# EAGLE board jobygnss_v2.1_final (EAGLE 5.11), part 1 of 3
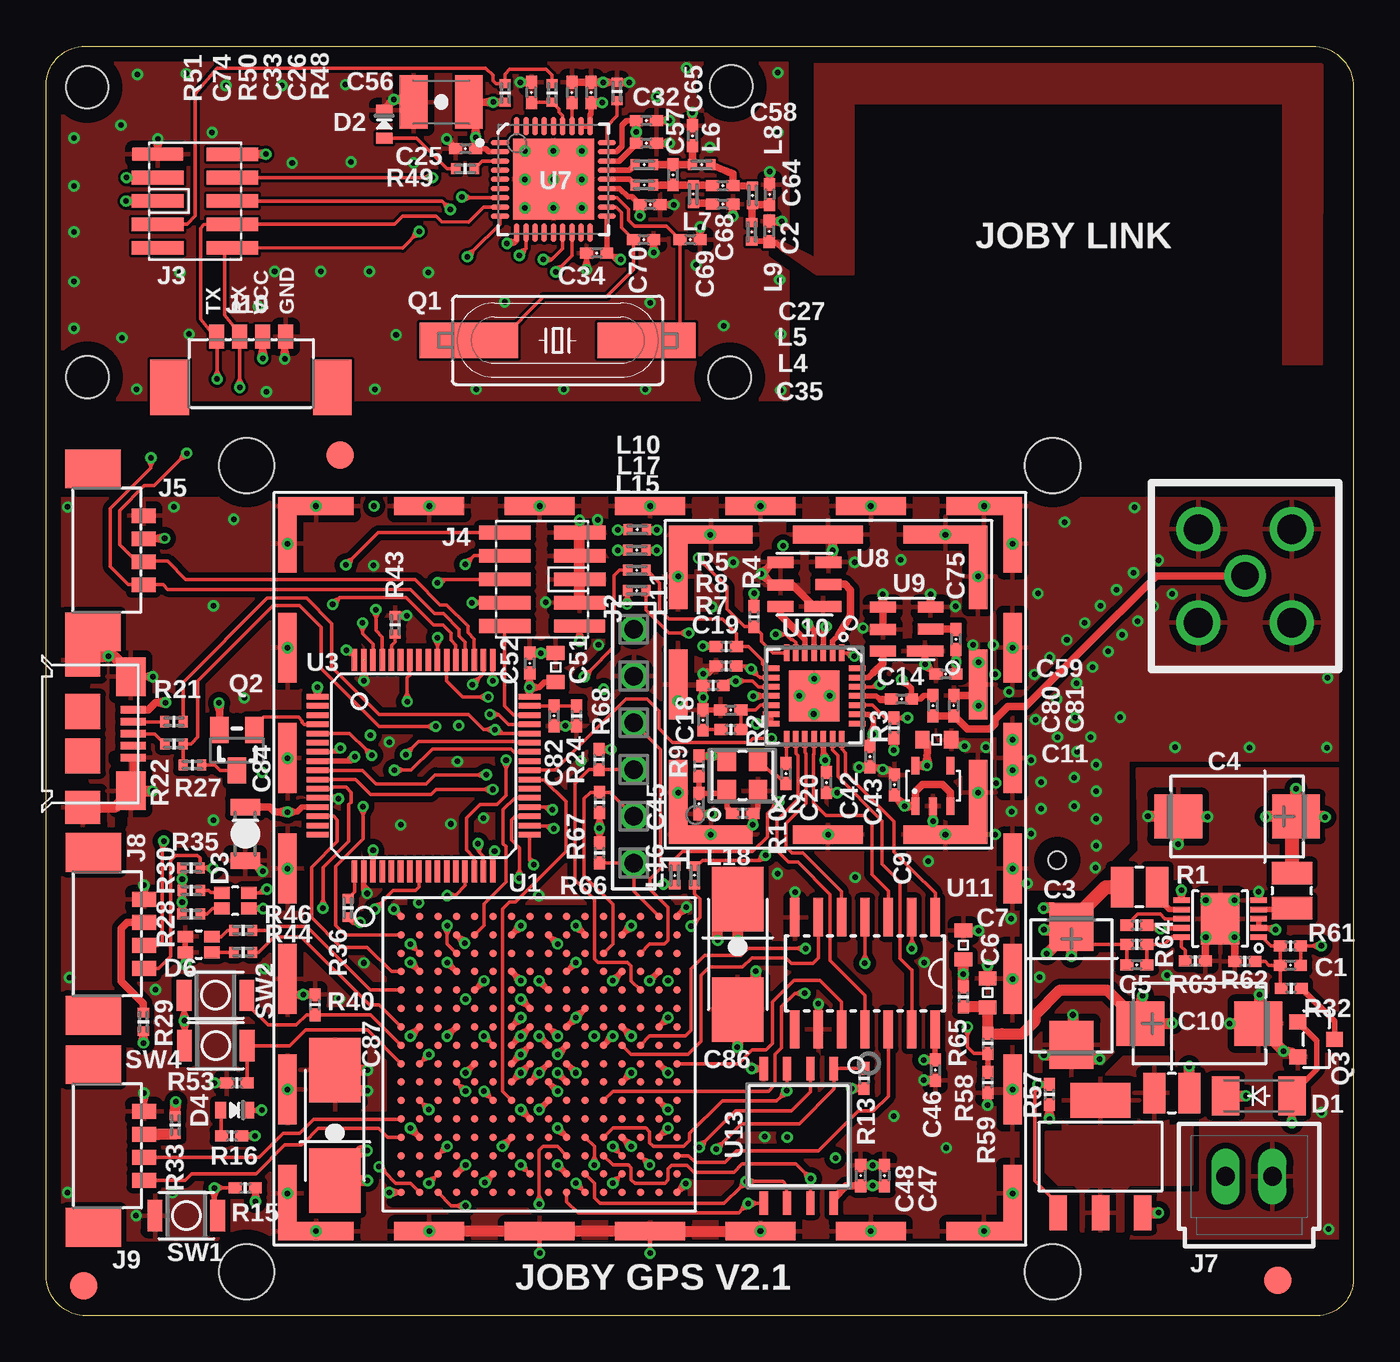
[diagram p5: board, top side]
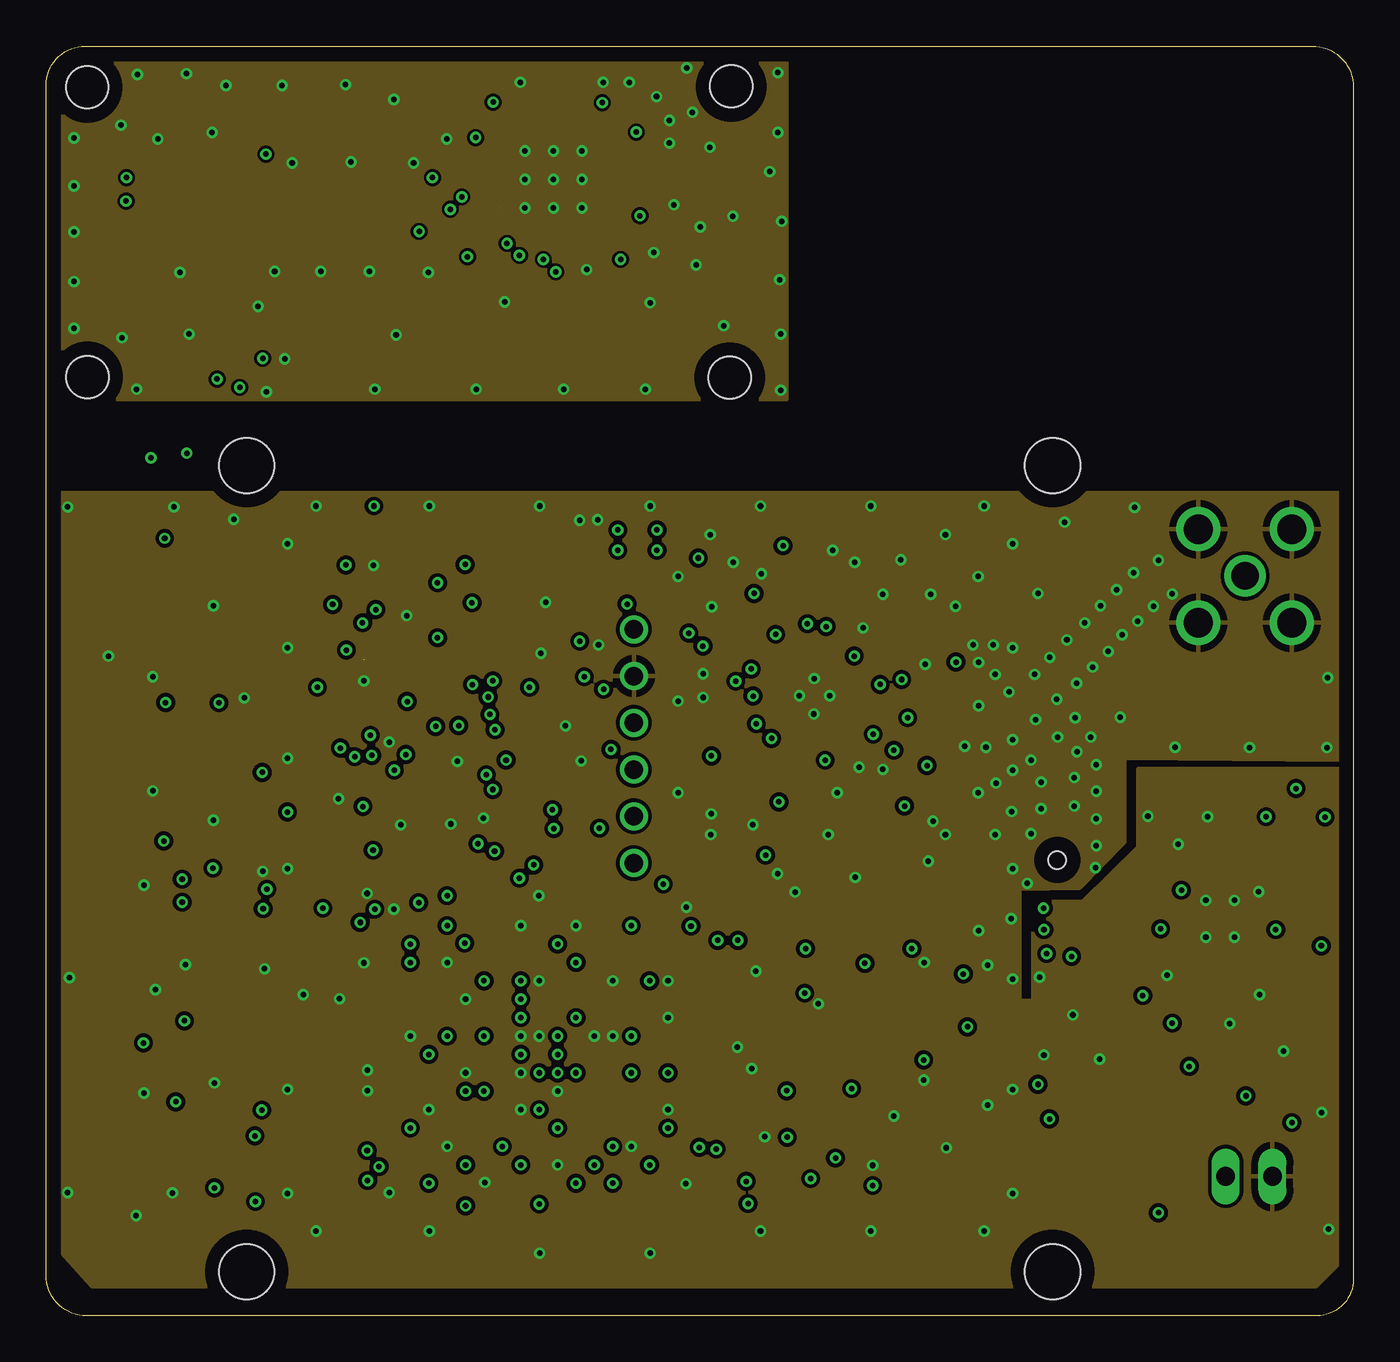
[diagram p6: board, inner layer Route2]
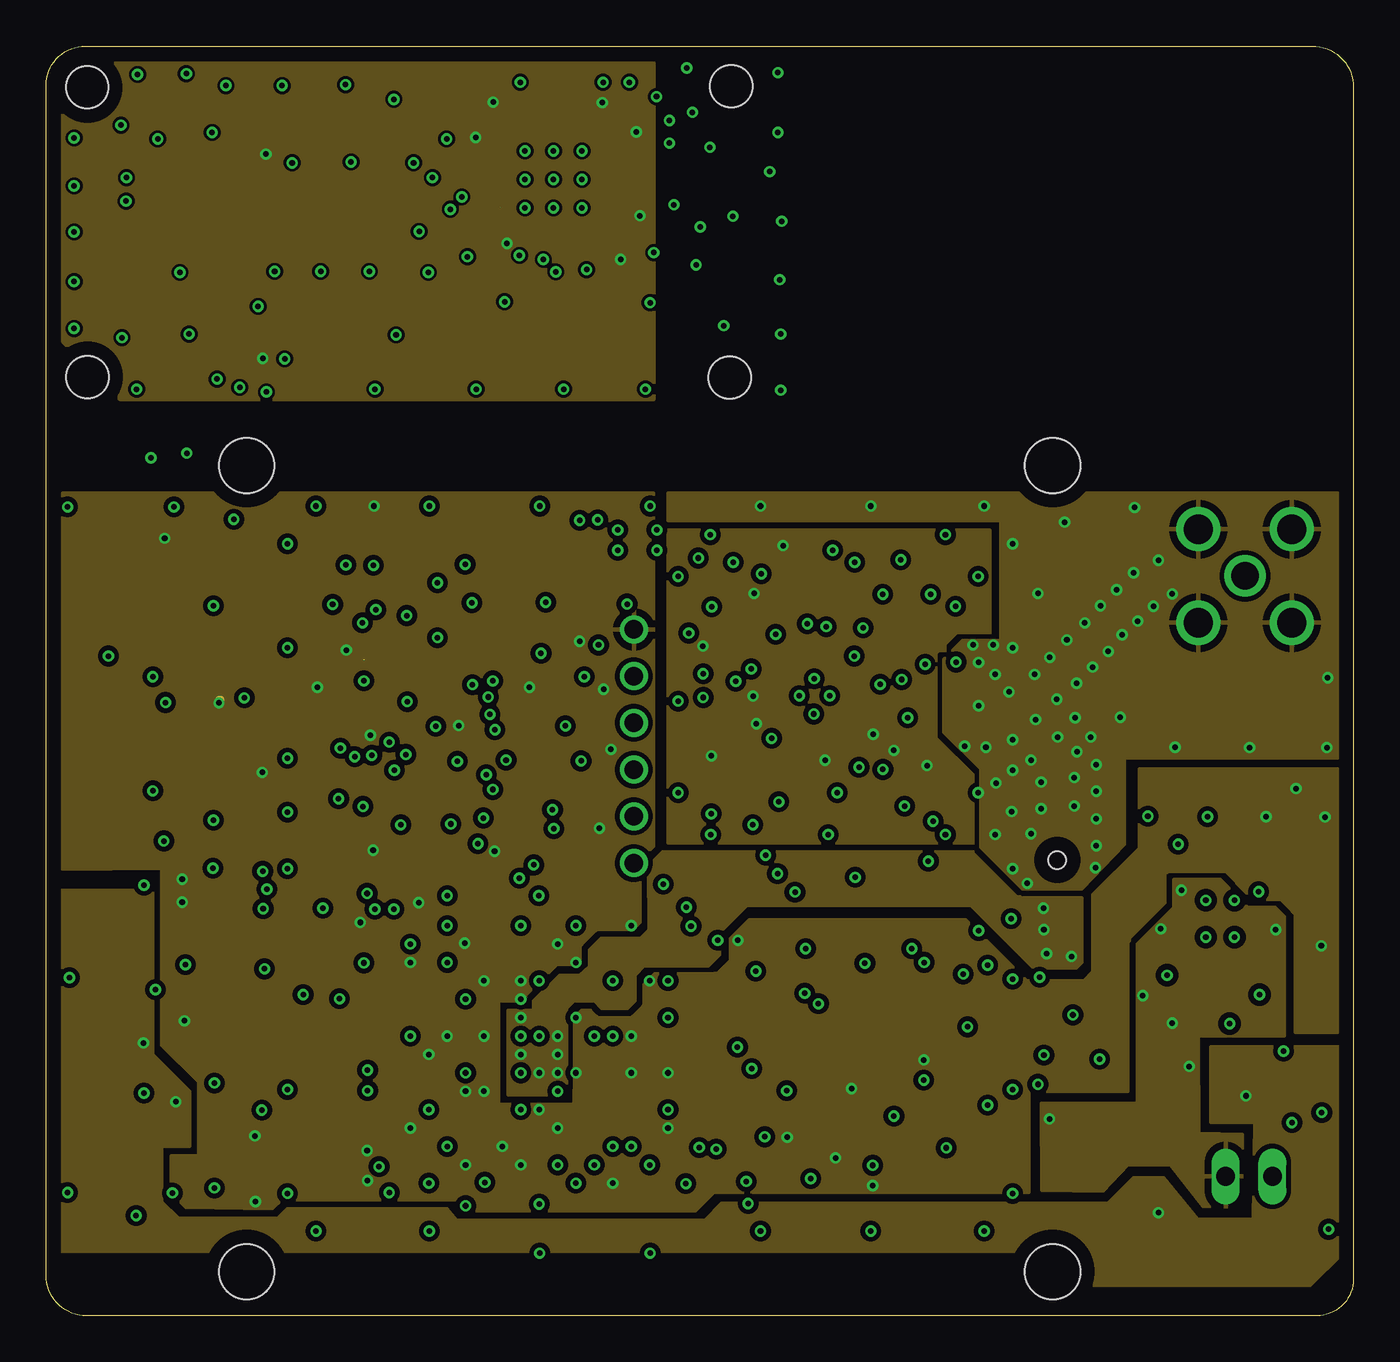
[diagram p7: board, inner layer Route15]
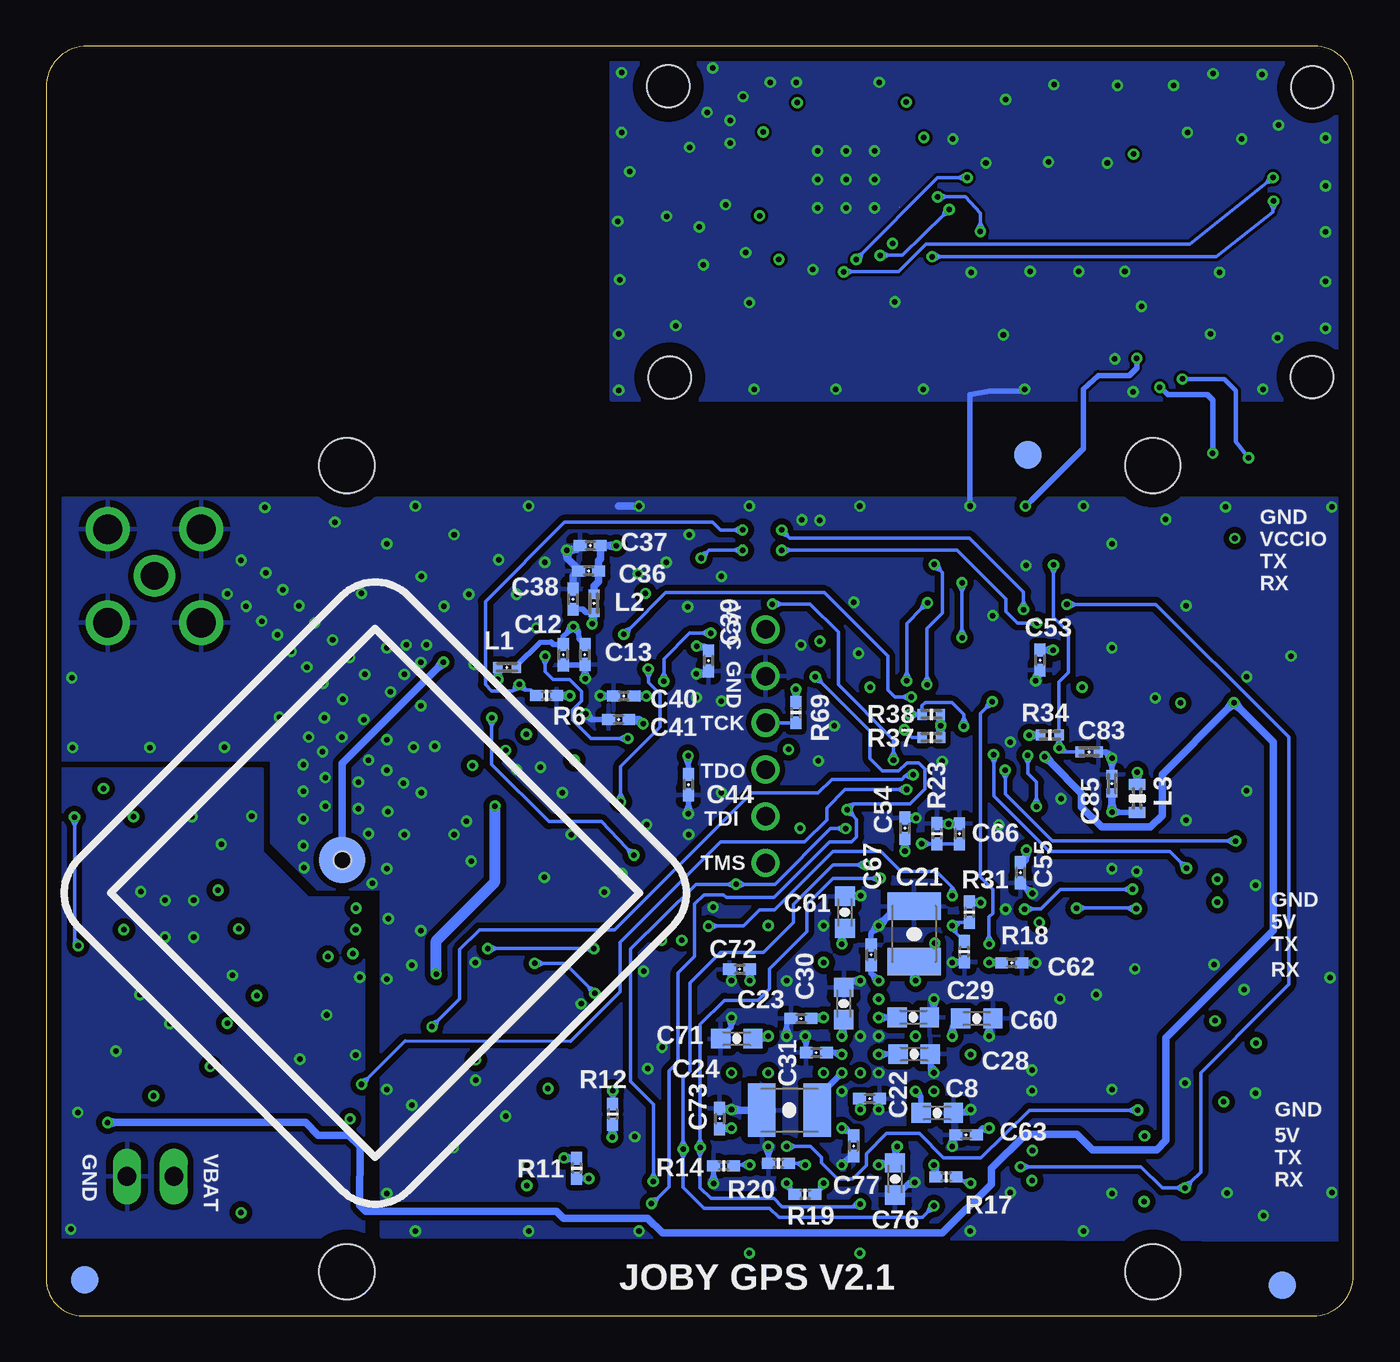
[diagram p8: board, bottom side, seen from below]

Size 71.05 x 69 mm. Coordinates in mm from the lower left corner, seen from the top.
Outline: 0,66.85 arc-90 2.15,69 68.8,69 arc-90 71.05,66.75 71.05,2 arc-90 69.05,0 2.2,0 arc-90 0,2.2 0,66.85
Copper layers (1+2*15+16): Top 0.035mm / dielectric 0.25mm / Route2 0.035mm / dielectric 0.25mm / Route15 0.035mm / dielectric 0.25mm / Bottom 0.035mm
Design rules "default *": minimum track width 6mil, minimum drill 0.3mm, track to track 6mil, track to pad 6mil, pad to pad 6mil, via to via 6mil, smd to smd 6mil, copper to edge 30mil, drill to drill 8mil, minimum pad ring 10mil, minimum via ring 0.145mm, stop-mask expansion 4mil, vias tented up to drill 0.3mm, thermal gap 15mil
Holes 2.3 mm at 2.24,66.76 2.25,51.01 37.15,50.98 37.24,66.81
Holes 3 mm at 10.9,46.2 54.7,46.2 10.9,2.4 54.7,2.4
tRestrict: area 18.8,6.2 to 34.6,22; area 12.9,8.4 to 13.1,8.5; area 10.1,28.4 to 10.3,28.5; area 12.3,30.2 to 12.4,30.4; area 1.9,28.8 to 2.1,28.9; area 3.7,30.2 to 3.8,30.4; area 1.9,34.3 to 2.1,34.4; area 13.8,36.2 to 13.9,36.4; area 27.5,31.3 to 27.7,31.4; area 25.7,35.9 to 25.8,36.1; area 28.4,35.9 to 28.4,36.1; area 44.7,29.2 to 44.9,29.3; area 10.3,32.4 to 10.5,32.5; area 12.4,12.2 to 12.4,12.4; area 4.5,14.9 to 4.6,15.1; area 4.1,26.7 to 4.1,26.9; area 37.1,14.2 to 37.1,14.4; area 37.9,12.9 to 38.1,13; area 39.1,20.4 to 39.2,20.6; area 47.5,34.8 to 47.7,34.9; area 43.9,30.3 to 44.1,30.4; area 43.2,28 to 43.4,28; area 34.2,32.1 to 34.5,32.2; area 41.6,35.2 to 41.9,35.2; area 41.6,32.1 to 41.9,32.2; area 43.2,33.6 to 43.3,33.8; area 40.1,33.6 to 40.2,33.8; area 51.8,41.9 to 51.8,42.1; area 51.3,42.4 to 51.4,42.6; area 67.9,14.8 to 68.1,14.8

## Footprints (pad centres in the part's own frame; a part is rotated, then mirrored left to right if it is on the bottom)
GPS_PATCH_ANTENNA = smd 2.54 x 2.54: P$1 0,-2.54 | hole 0.965: 0,-2.54
C0402 = smd 0.7 x 0.6: 1 -0.55,0; 2 0.55,0
CT7343 = smd 2.6 x 2.4: + -3.2,0; - 3.2,0
0603 = smd 0.762 x 0.965: 1 -0.787,0; 2 0.787,0
C0603K = smd 1.05 x 1.08: 1 -0.875,0; 2 0.875,0
C1210K = smd 1.5 x 2.9: 1 -1.5,0; 2 1.5,0
0402-CAP = smd 0.5 x 0.6: P$1 -0.5,0; P$2 0.5,0
1206-POL-CAP = smd 0.9 x 1.6: + -1.45,0; - 1.45,0
6032/C = smd 3.5 x 2.8: + -3,0; - 3,0
SOD-123_MINI-SMA = smd 1.5 x 2.1: A 1.8,0; C -1.8,0
0603-LED = smd 0.6 x 0.9: A 0.75,0; C -0.75,0
LTST-C195KGJRKT = smd 0.65 x 0.85: GA 0.425,0.725; GC 0.425,-0.725; RA -0.425,0.725; RC -0.425,-0.725
SMA = drill 1.499 round: P$1 0,0 | drill 1.6 round: P$2 2.54,2.54; P$3 2.54,-2.54; P$4 -2.54,-2.54; P$5 -2.54,2.54
SSW-106-02-S-S = drill 1 pad 1.524 round: 1 -6.35,0; 2 -3.81,0; 3 -1.27,0; 4 1.27,0; 5 3.81,0; 6 6.35,0
FTSH-105-DV = smd 0.74 x 2.8: 1 -2.54,-2.03; 2 -2.54,2.03; 3 -1.27,-2.03; 4 -1.27,2.03; 5 0,-2.03; 6 0,2.03; 7 1.27,-2.03; 8 1.27,2.03; 9 2.54,-2.03; 10 2.54,2.03
PB-53398-04 = smd 0.8 x 1.3: 1 -1.875,1.25; 2 -0.625,1.25; 3 0.625,1.25; 4 1.875,1.25 | smd 2.1 x 3: PAD1 -4.425,-1.5; PAD2 4.425,-1.5
ZX62-B-5PA = smd 1.8 x 1.9: GND_LEFT -4,0; GND_RIGHT 4,0 | smd 1.9 x 1.9: GND_MID_LEFT -1.2,0; GND_MID_RIGHT 1.2,0 | smd 2.1 x 1.6: GND_UP_LEFT -3.1,2.6; GND_UP_RIGHT 3.1,2.6 | smd 0.4 x 1.35: PIN_1 -1.3,2.725; PIN_2 -0.65,2.725; PIN_3 0,2.725; PIN_4 0.65,2.725; PIN_5 1.3,2.725
70543-02 = drill 1.016 long: 1 -1.27,0; 2 1.27,0
FIDUCIAL-1.5X3 = smd 1.5 x 1.5: 1 0,0
0402-IND = smd 0.5 x 0.6: P$1 -0.5,0; P$2 0.5,0
0603-IND@1 = smd 0.6 x 0.9: P$1 -0.75,0; P$2 0.75,0
LQM2HPN4R7MG0L = smd 1.2 x 2.2: 1 -0.95,0; 2 0.95,0
HC49UP = smd 5.334 x 1.93: 1 -4.826,0; 2 4.826,0
SOT23 = smd 1 x 1.4: 1 -0.95,-1.1; 2 0.95,-1.1; 3 0,1.1
2N7002 = smd 0.8 x 0.9: D 0,0; G -0.95,-2; S 0.95,-2
FDT458P_SOT223 = smd 0.95 x 1.9: 1 -2.3,-6.1; 2 0,-6.1; 3 2.3,-6.1 | smd 3.25 x 1.9: 4 0,0
R0402 = smd 0.7 x 0.6: 1 -0.55,0; 2 0.55,0
0402-RES = smd 0.5 x 0.6: P$1 -0.5,0; P$2 0.5,0
BMI-S-202 = smd 4.55 x 1: 1 2.275,0.5; 3 15.025,0.5; 7 15.025,16.8; 9 2.275,16.8 | smd 3.8 x 1: 2 8.65,0.5; 8 8.65,16.8 | smd 1 x 3.55: 4 16.8,2.775; 6 16.8,14.525; 10 0.5,14.525; 12 0.5,2.775 | smd 1 x 3.8: 5 16.8,8.65; 11 0.5,8.65
BMI-S-208 = smd 4.1 x 1: 1 2.05,0.5; 3 38.35,0.5; 7 38.35,39.9; 9 2.05,39.9 | smd 3.8 x 1: 2 8.2,0.5; 8 8.2,39.9; 13 14.2,0.5; 14 20.2,0.5; 15 26.2,0.5; 16 32.2,0.5; 25 14.2,39.9; 26 20.2,39.9; 27 26.2,39.9; 28 32.2,39.9 | smd 1 x 3.1: 4 39.9,2.55; 6 39.9,37.85; 10 0.5,37.85; 12 0.5,2.55 | smd 1 x 3.8: 5 39.9,8.2; 11 0.5,8.2; 17 39.9,14.2; 18 39.9,20.2; 19 39.9,32.2; 20 0.5,14.2; 21 39.9,26.2; 22 0.5,20.2; 23 0.5,26.2; 24 0.5,32.2
B3U-1000P = smd 0.8 x 1.7: P$1 -1.7,0; P$2 1.7,0
FT256 = smd 0.4 x 0.4: A1 -7.5,7.5; A2 -6.5,7.5; A3 -5.5,7.5; A4 -4.5,7.5; A5 -3.5,7.5; A6 -2.5,7.5; A7 -1.5,7.5; A8 -0.5,7.5; A9 0.5,7.5; A10 1.5,7.5; A11 2.5,7.5; A12 3.5,7.5; A13 4.5,7.5; A14 5.5,7.5; A15 6.5,7.5; A16 7.5,7.5; B1 -7.5,6.5; B2 -6.5,6.5; B3 -5.5,6.5; B4 -4.5,6.5; B5 -3.5,6.5; B6 -2.5,6.5; B7 -1.5,6.5; B8 -0.5,6.5; B9 0.5,6.5; B10 1.5,6.5; B11 2.5,6.5; B12 3.5,6.5; B13 4.5,6.5; B14 5.5,6.5; B15 6.5,6.5; B16 7.5,6.5; C1 -7.5,5.5; C2 -6.5,5.5; C3 -5.5,5.5; C4 -4.5,5.5; C5 -3.5,5.5; C6 -2.5,5.5; C7 -1.5,5.5; C8 -0.5,5.5; C9 0.5,5.5; C10 1.5,5.5; C11 2.5,5.5; C12 3.5,5.5; C13 4.5,5.5; C14 5.5,5.5; C15 6.5,5.5; C16 7.5,5.5; D1 -7.5,4.5; D2 -6.5,4.5; D3 -5.5,4.5; D4 -4.5,4.5; D5 -3.5,4.5; D6 -2.5,4.5; D7 -1.5,4.5; D8 -0.5,4.5; D9 0.5,4.5; D10 1.5,4.5; D11 2.5,4.5; D12 3.5,4.5; D13 4.5,4.5; D14 5.5,4.5; D15 6.5,4.5; D16 7.5,4.5; E1 -7.5,3.5; E2 -6.5,3.5; E3 -5.5,3.5; E4 -4.5,3.5; E5 -3.5,3.5; E6 -2.5,3.5; E7 -1.5,3.5; E8 -0.5,3.5; E9 0.5,3.5; E10 1.5,3.5; E11 2.5,3.5; E12 3.5,3.5; E13 4.5,3.5; E14 5.5,3.5; E15 6.5,3.5; E16 7.5,3.5; F1 -7.5,2.5; F2 -6.5,2.5; F3 -5.5,2.5; F4 -4.5,2.5; F5 -3.5,2.5; F6 -2.5,2.5; F7 -1.5,2.5; F8 -0.5,2.5; F9 0.5,2.5; F10 1.5,2.5; F11 2.5,2.5; F12 3.5,2.5; F13 4.5,2.5; F14 5.5,2.5; F15 6.5,2.5; F16 7.5,2.5; G1 -7.5,1.5; G2 -6.5,1.5; G3 -5.5,1.5; G4 -4.5,1.5; G5 -3.5,1.5; G6 -2.5,1.5; G7 -1.5,1.5; G8 -0.5,1.5; G9 0.5,1.5; G10 1.5,1.5; G11 2.5,1.5; G12 3.5,1.5; G13 4.5,1.5; G14 5.5,1.5; G15 6.5,1.5; G16 7.5,1.5; H1 -7.5,0.5; H2 -6.5,0.5; H3 -5.5,0.5; H4 -4.5,0.5; H5 -3.5,0.5; H6 -2.5,0.5; H7 -1.5,0.5; H8 -0.5,0.5; H9 0.5,0.5; H10 1.5,0.5; H11 2.5,0.5; H12 3.5,0.5; H13 4.5,0.5; H14 5.5,0.5; H15 6.5,0.5; H16 7.5,0.5; J1 -7.5,-0.5; J2 -6.5,-0.5; J3 -5.5,-0.5; J4 -4.5,-0.5; J5 -3.5,-0.5; J6 -2.5,-0.5; J7 -1.5,-0.5; J8 -0.5,-0.5; J9 0.5,-0.5; J10 1.5,-0.5; J11 2.5,-0.5; J12 3.5,-0.5; J13 4.5,-0.5; J14 5.5,-0.5; J15 6.5,-0.5; J16 7.5,-0.5; K1 -7.5,-1.5; K2 -6.5,-1.5; K3 -5.5,-1.5; K4 -4.5,-1.5; K5 -3.5,-1.5; K6 -2.5,-1.5; K7 -1.5,-1.5; K8 -0.5,-1.5; K9 0.5,-1.5; K10 1.5,-1.5; K11 2.5,-1.5; K12 3.5,-1.5; K13 4.5,-1.5; K14 5.5,-1.5; K15 6.5,-1.5; K16 7.5,-1.5; L1 -7.5,-2.5; L2 -6.5,-2.5; L3 -5.5,-2.5; L4 -4.5,-2.5; L5 -3.5,-2.5; L6 -2.5,-2.5; L7 -1.5,-2.5; L8 -0.5,-2.5; L9 0.5,-2.5; L10 1.5,-2.5; L11 2.5,-2.5; L12 3.5,-2.5; L13 4.5,-2.5; L14 5.5,-2.5; L15 6.5,-2.5; L16 7.5,-2.5; M1 -7.5,-3.5; M2 -6.5,-3.5; M3 -5.5,-3.5; M4 -4.5,-3.5; M5 -3.5,-3.5; M6 -2.5,-3.5; M7 -1.5,-3.5; M8 -0.5,-3.5; M9 0.5,-3.5; M10 1.5,-3.5; M11 2.5,-3.5; M12 3.5,-3.5; M13 4.5,-3.5; M14 5.5,-3.5; M15 6.5,-3.5; M16 7.5,-3.5; N1 -7.5,-4.5; N2 -6.5,-4.5; N3 -5.5,-4.5; N4 -4.5,-4.5; N5 -3.5,-4.5; N6 -2.5,-4.5; N7 -1.5,-4.5; N8 -0.5,-4.5; N9 0.5,-4.5; N10 1.5,-4.5; N11 2.5,-4.5; N12 3.5,-4.5; N13 4.5,-4.5; N14 5.5,-4.5; N15 6.5,-4.5; N16 7.5,-4.5; P1 -7.5,-5.5; P2 -6.5,-5.5; P3 -5.5,-5.5; P4 -4.5,-5.5; P5 -3.5,-5.5; P6 -2.5,-5.5; P7 -1.5,-5.5; P8 -0.5,-5.5; P9 0.5,-5.5; P10 1.5,-5.5; P11 2.5,-5.5; P12 3.5,-5.5; P13 4.5,-5.5; P14 5.5,-5.5; P15 6.5,-5.5; P16 7.5,-5.5; R1 -7.5,-6.5; R2 -6.5,-6.5; R3 -5.5,-6.5; R4 -4.5,-6.5; R5 -3.5,-6.5; R6 -2.5,-6.5; R7 -1.5,-6.5; R8 -0.5,-6.5; R9 0.5,-6.5; R10 1.5,-6.5; R11 2.5,-6.5; R12 3.5,-6.5; R13 4.5,-6.5; R14 5.5,-6.5; R15 6.5,-6.5; R16 7.5,-6.5; T1 -7.5,-7.5; T2 -6.5,-7.5; T3 -5.5,-7.5; T4 -4.5,-7.5; T5 -3.5,-7.5; T6 -2.5,-7.5; T7 -1.5,-7.5; T8 -0.5,-7.5; T9 0.5,-7.5; T10 1.5,-7.5; T11 2.5,-7.5; T12 3.5,-7.5; T13 4.5,-7.5; T14 5.5,-7.5; T15 6.5,-7.5; T16 7.5,-7.5
MSOP10 = smd 0.305 x 0.889: 1 -1,-2.1; 2 -0.5,-2.1; 3 0,-2.1; 4 0.5,-2.1; 5 1,-2.1; 6 1,2.1; 7 0.5,2.1; 8 0,2.1; 9 -0.5,2.1; 10 -1,2.1 | smd 2.794 x 2.083: GP 0,0
LQFP64 = smd 1.2 x 0.3: 1 -5.75,3.75; 2 -5.75,3.25; 3 -5.75,2.75; 4 -5.75,2.25; 5 -5.75,1.75; 6 -5.75,1.25; 7 -5.75,0.75; 8 -5.75,0.25; 9 -5.75,-0.25; 10 -5.75,-0.75; 11 -5.75,-1.25; 12 -5.75,-1.75; 13 -5.75,-2.25; 14 -5.75,-2.75; 15 -5.75,-3.25; 16 -5.75,-3.75; 33 5.75,-3.75; 34 5.75,-3.25; 35 5.75,-2.75; 36 5.75,-2.25; 37 5.75,-1.75; 38 5.75,-1.25; 39 5.75,-0.75; 40 5.75,-0.25; 41 5.75,0.25; 42 5.75,0.75; 43 5.75,1.25; 44 5.75,1.75; 45 5.75,2.25; 46 5.75,2.75; 47 5.75,3.25; 48 5.75,3.75 | smd 0.3 x 1.2: 17 -3.75,-5.75; 18 -3.25,-5.75; 19 -2.75,-5.75; 20 -2.25,-5.75; 21 -1.75,-5.75; 22 -1.25,-5.75; 23 -0.75,-5.75; 24 -0.25,-5.75; 25 0.25,-5.75; 26 0.75,-5.75; 27 1.25,-5.75; 28 1.75,-5.75; 29 2.25,-5.75; 30 2.75,-5.75; 31 3.25,-5.75; 32 3.75,-5.75; 49 3.75,5.75; 50 3.25,5.75; 51 2.75,5.75; 52 2.25,5.75; 53 1.75,5.75; 54 1.25,5.75; 55 0.75,5.75; 56 0.25,5.75; 57 -0.25,5.75; 58 -0.75,5.75; 59 -1.25,5.75; 60 -1.75,5.75; 61 -2.25,5.75; 62 -2.75,5.75; 63 -3.25,5.75; 64 -3.75,5.75
QFN50P595X595X90-37N = smd 1 x 0.3: 1 -2.9,2; 2 -2.9,1.5; 3 -2.9,1; 4 -2.9,0.5; 5 -2.9,0; 6 -2.9,-0.5; 7 -2.9,-1; 8 -2.9,-1.5; 9 -2.9,-2; 19 2.9,-2; 20 2.9,-1.5; 21 2.9,-1; 22 2.9,-0.5; 23 2.9,0; 24 2.9,0.5; 25 2.9,1; 26 2.9,1.5; 27 2.9,2 | smd 0.3 x 1: 10 -2,-2.9; 11 -1.5,-2.9; 12 -1,-2.9; 13 -0.5,-2.9; 14 0,-2.9; 15 0.5,-2.9; 16 1,-2.9; 17 1.5,-2.9; 18 2,-2.9; 28 2,2.9; 29 1.5,2.9; 30 1,2.9; 31 0.5,2.9; 32 0,2.9; 33 -0.5,2.9; 34 -1,2.9; 35 -1.5,2.9; 36 -2,2.9 | smd 4.4 x 4.4: 37 0,0
B4050 = smd 2 x 0.6: 1 -1,1.2 | smd 1.4 x 0.6: 2 -1.3,0; 3 -1.3,-1.2; 4 1.3,-1.2; 5 1.3,0.025; 6 1.3,1.2
MAX2769 = smd 0.3 x 0.9: 1 -1.5,-2.34; 2 -1,-2.34; 3 -0.5,-2.34; 4 0,-2.34; 5 0.5,-2.34; 6 1,-2.34; 7 1.5,-2.34; 15 1.5,2.34; 16 1,2.34; 17 0.5,2.34; 18 0,2.34; 19 -0.5,2.34; 20 -1,2.34; 21 -1.5,2.34 | smd 0.9 x 0.3: 8 2.34,-1.5; 9 2.34,-1; 10 2.34,-0.5; 11 2.34,0; 12 2.34,0.5; 13 2.34,1; 14 2.34,1.5; 22 -2.34,1.5; 23 -2.34,1; 24 -2.34,0.5; 25 -2.34,0; 26 -2.34,-0.5; 27 -2.34,-1; 28 -2.34,-1.5 | smd 2.75 x 2.75: 29 0,0
SN74LVC07A_SOIC = smd 0.508 x 2.083: 1 -3.81,-3.048; 2 -2.54,-3.048; 3 -1.27,-3.048; 4 0,-3.048; 5 1.27,-3.048; 6 2.54,-3.048; 7 3.81,-3.048; 8 3.81,3.048; 9 2.54,3.048; 10 1.27,3.048; 11 0,3.048; 12 -1.27,3.048; 13 -2.54,3.048; 14 -3.81,3.048
PT7M8206B33TA5EX = smd 0.45 x 0.95: 1 0.95,1.1; 2 0,1.1; 3 -0.95,1.1; 4 -0.95,-1.1; 5 0.95,-1.1
M25P = smd 0.45 x 1.27: P$1 -1.905,-3.65; P$2 -0.635,-3.65; P$3 0.635,-3.65; P$4 1.905,-3.65; P$5 1.905,3.65; P$6 0.635,3.65; P$7 -0.635,3.65; P$8 -1.905,3.65
ASVTX-11 = smd 1 x 1.2: 1 -0.85,-0.85; 3 0.85,-0.838; 4 0.85,0.85; 6 -0.85,0.85

## Placement (x,y rotation side)
ANT1  GPS_PATCH_ANTENNA  [GPS_PATCH_ANTENNA]  53.16,22.97 225 bottom
C1  22pF  [C0402]  67.62,19.05 0 top
C2  DNP  [C0402]  39.3,58.92 90 top
C3  10UF_TANT  [CT7343]  55.73,17.92 270 top
C4  10UF_TANT  [CT7343]  64.72,27.12 180 top
C5  22pF  [C0402]  59.27,19.07 0 top
C6  2.2uF  [0603]  51.17,17.55 270 top
C7  2.2uF  [0603]  49.85,20.15 270 top
C8  4.7uF  [C0603K]  22.62,11.02 0 bottom
C9  0.01uF  [C0402]  46.1,28.85 90 top
C10  10UF_TANT  [CT7343]  62.67,15.88 0 top
C11  10uF  [0603]  48.4,31.3 180 top
C12  100pF  [C0402]  42.94,35.92 270 bottom
C13  0.1uF  [C0402]  41.77,35.93 270 bottom
C14  100pF  [C0402]  46.49,33.51 180 top
C18  0.47nF  [C0402]  35.7,32.37 90 top
C19  27pF  [C0402]  37.21,32.91 180 top
C20  0.1uF  [C0402]  40.2,29.47 270 top
C21  100uF  [C1210K]  23.88,20.75 90 bottom
C22  0.47uF  [C0402]  26.3,11.8 0 bottom
C23  0.47uF  [C0402]  30.02,16.15 180 bottom
C24  100uF  [C1210K]  30.65,11.17 180 bottom
C25  0.1uF  [C0402]  22.8,63.42 180 top
C26  0.1uF  [C0402]  29.62,66.47 90 top
C27  0.1uF  [C0402]  32.63,63.72 0 top
C28  4.7uF  [C0603K]  23.87,14.22 0 bottom
C29  4.7uF  [C0603K]  23.92,16.22 0 bottom
C30  4.7uF  [C0603K]  27.7,16.97 90 bottom
C31  0.47uF  [C0402]  29.19,14.3 180 bottom
C32  0.1uF  [C0402]  32.63,64.95 0 top
C33  1uF  [C0402]  28.57,66.47 90 top
C34  0.1uF  [C0402]  29.93,57.75 180 top
C35  0.1uF  [C0402]  32.83,60.38 0 top
C36  0.1uF  [C0402]  41.57,40.48 180 bottom
C37  100pF  [C0402]  41.48,41.85 180 bottom
C38  12pF  [C0402]  42.41,38.94 90 bottom
C39  0.1uF  [C0402]  35.05,35.59 270 bottom
C40  0.1uF  [C0402]  39.65,33.68 180 bottom
C41  0.1uF  [C0402]  39.93,32.4 180 bottom
C42  0.1uF  [C0402]  42.4,28.97 270 top
C43  0.1uF  [C0402]  44.78,30.38 270 top
C44  0.01uF  [C0402]  36.14,28.86 270 bottom
C45  0.01uF  [C0402]  35.48,27.82 270 top
C46  0.1uF  [C0402]  48.33,13.35 270 top
C47  1uF  [C0402]  45.57,7.61 90 top
C48  0.01uF  [C0402]  44.27,7.62 90 top
C51  4.7uF  [0603]  27.7,35.23 270 top
C52  0.1uF  [C0402]  26.29,35.47 90 top
C53  0.1uF  [C0402]  17.03,35.63 270 bottom
C54  0.1uF  [C0402]  24.38,26.49 90 bottom
C55  0.1uF  [C0402]  18.1,24.08 270 bottom
C56  100uF  [C1210K]  21.48,65.95 180 top
C57  1pF  [C0402]  34.07,62 90 top
C58  1uF  [C0402]  36.77,61.4 0 top
C59  DNP  [C0402]  48.9,34.88 0 top
C60  4.7uF  [C0603K]  20.47,16.15 0 bottom
C61  4.7uF  [C0603K]  27.64,21.92 90 bottom
C62  0.47uF  [C0402]  18.57,19.18 0 bottom
C63  0.47uF  [C0402]  21.05,9.84 180 bottom
C64  DNP  [C0402]  39.32,60.92 90 top
C65  1.5pF  [C0402]  35.12,64.12 90 top
C66  0.1uF  [C0402]  21.41,26.19 90 bottom
C67  0.47uF  [C0402]  26.21,19.61 90 bottom
C68  100pF  [C0402]  36.77,60.4 0 top
C69  33pF  [C0402]  35,58.47 0 top
C70  33pF  [C0402]  32.48,58.47 0 top
C71  4.7uF  [C0603K]  33.51,15.06 180 bottom
C72  0.47uF  [C0402]  33.36,18.84 180 bottom
C73  0.47uF  [C0402]  34.44,10.71 90 bottom
C74  1000pF  [C0402]  26.38,66.47 90 top
C75  0R  [C0402]  49.45,36.75 270 top
C76  4.7uF  [C0603K]  24.91,7.44 270 bottom
C77  0.47uF  [C0402]  27.16,9.23 270 bottom
C80  0R  [C0402]  48.2,33.15 270 top
C81  DNP  [C0402]  49.33,33.15 270 top
C82  0.1uF  [C0402]  27.61,32.59 90 top
C83  100nF  [0402-CAP]  14.37,30.64 180 bottom
C84  1uF  [1206-POL-CAP]  10.83,26.19 270 top
C85  10nF  [0402-CAP]  13.12,28.9 270 bottom
C86  220uF  [6032/C]  37.59,19.64 270 top
C87  220uF  [6032/C]  15.7,10.35 90 top
D1  1N581  [SOD-123_MINI-SMA]  65.9,11.95 0 top
D2  LED-0603  [0603-LED]  18.37,64.75 270 top
D3  LTST-C195KGJRKT  [LTST-C195KGJRKT]  10.29,22.55 90 top
D4  LED-0603  [0603-LED]  10.25,11.17 180 top
D6  LTST-C195KGJRKT  [LTST-C195KGJRKT]  8.3,20.18 270 top
DRILEGEND  [DRILEGEND]  -0.86,-3.84 0 top  (outside the outline)
J1  SMA  [SMA]  65.16,40.2 90 top
J2  6_PIN_100MIL  [SSW-106-02-S-S]  31.95,30.95 90 top
J3  DEBUG HDR  [FTSH-105-DV]  8.1,60.57 270 top
J4  PIN_HDR_EDG_1.27MM_5-2  [FTSH-105-DV]  26.96,40.02 90 top
J5  RF LINK  [PB-53398-04]  4.05,41.6 270 top
J6  ZX62-B-5PA  [ZX62-B-5PA]  2.01,31.62 270 top
J7  C-GRID-02-70543  [70543-02]  65.38,7.57 0 top
J8  CON_UART1  [PB-53398-04]  4.08,20.75 270 top
J9  CON_UART3  [PB-53398-04]  4.08,9.23 270 top
J10  RF LINK  [PB-53398-04]  11.15,51.95 0 top
JP5  FIDUCIAL1.5X3  [FIDUCIAL-1.5X3]  17.68,46.78 0 bottom
JP6  FIDUCIAL1.5X3  [FIDUCIAL-1.5X3]  3.87,1.66 270 bottom
JP7  FIDUCIAL1.5X3  [FIDUCIAL-1.5X3]  68.94,1.95 270 bottom
JP8  FIDUCIAL1.5X3  [FIDUCIAL-1.5X3]  2.06,1.64 0 top
JP9  FIDUCIAL1.5X3  [FIDUCIAL-1.5X3]  15.99,46.78 0 top
JP10  FIDUCIAL1.5X3  [FIDUCIAL-1.5X3]  66.94,1.94 90 top
L1  250nH/DNP  [0402-IND]  46,35.23 0 bottom
L2  36nH  [0402-IND]  41.27,38.71 90 bottom
L3  [0603-IND@1]  11.75,28.11 270 bottom
L4  12nH  [0402-IND]  32.5,61.45 0 top
L5  12nH  [0402-IND]  32.5,62.55 0 top
L6  18nH  [0402-IND]  35.63,62.55 0 top
L7  18nH  [0402-IND]  35.18,60.95 270 top
L8  DNP  [0402-IND]  38.4,60.88 90 top
L9  DNP  [0402-IND]  38.35,58.9 90 top
L10  [0402-IND]  32.12,42.72 180 top
L11  [0402-IND]  32.11,39.42 180 top
L12  4.7uH  [LQM2HPN4R7MG0L]  61.18,12.1 180 top
L13  4.7uH  [LQM2HPN4R7MG0L]  67.7,23.1 270 top
L14  4.7uH  [LQM2HPN4R7MG0L]  59.42,23.3 180 top
L15  [0402-IND]  32.11,40.51 180 top
L16  [0402-IND]  34.17,23.93 270 top
L17  [0402-IND]  32.11,41.61 180 top
L18  [0402-IND]  35.25,23.93 270 top
Q1  26MHz  [HC49UP]  27.8,53 180 top
Q2  DDTA143  [SOT23]  10.37,30.73 180 top
Q3  2N7002  [2N7002]  70.02,15.02 270 top
Q5  FDT458P  [FDT458P_SOT223]  57.3,11.7 0 top
R1  100K  [R0402]  59.28,21.22 0 top
R2  20k  [R0402]  37.22,31.86 0 top
R3  10K  [R0402]  46.09,31.94 270 top
R4  10K  [R0402]  38.48,37.99 90 top
R5  10K  [R0402]  36.96,36.38 180 top
R6  10K  [R0402]  43.85,33.7 180 bottom
R7  10K  [R0402]  36.25,34.26 0 top
R8  10K  [R0402]  36.96,35.31 0 top
R9  10k  [R0402]  35.49,29.87 90 top
R10  10k  [R0402]  37.86,27.31 180 top
R11  100k  [R0402]  42.21,8.02 90 bottom
R12  100k  [R0402]  40.26,10.95 270 bottom
R13  4K7  [R0402]  44.46,12.89 270 top
R14  10K  [R0402]  34.23,8.14 180 bottom
R15  4K7  [R0402]  10.83,6.94 180 top
R16  300  [R0402]  10.09,9.78 0 top
R17  4K7  [R0402]  22.14,7.54 0 bottom
R18  4K7  [R0402]  21.15,19.79 90 bottom
R19  4K7  [R0402]  29.8,6.59 180 bottom
R20  4K7  [R0402]  31.25,8.28 0 bottom
R21  22R  [0402-RES]  6.95,32.28 0 top
R22  22R  [0402-RES]  6.96,31.08 0 top
R23  0ohm/DNP  [R0402]  22.62,26.2 90 bottom
R24  0ohm/DNP  [R0402]  28.83,32.59 90 top
R27  1K5  [0402-RES]  7.96,29.93 0 top
R28  150  [0402-RES]  7.89,21.83 0 top
R29  0/DNP  [0402-RES]  5.3,15.97 90 top
R30  150  [0402-RES]  7.89,23.11 180 top
R31  0R/DNP  [R0402]  20.87,21.93 270 bottom
R32  475K  [R0402]  67.66,17.8 0 top
R33  0/DNP  [0402-RES]  7.03,10.36 270 top
R34  10k  [0402-RES]  16.5,31.56 180 bottom
R35  2k7  [0402-RES]  7.89,24.35 0 top
R36  2k7  [0402-RES]  16.41,22.16 90 top
R37  2k7  [0402-RES]  22.94,31.44 180 bottom
R38  2k7  [0402-RES]  22.94,32.69 180 bottom
R40  4K7  [R0402]  14.62,16.9 270 top
R43  2k7  [0402-RES]  18.97,37.55 270 top
R44  150  [0402-RES]  10.72,19.75 0 top
R46  150  [0402-RES]  10.71,20.94 0 top
R48  56k  [0402-RES]  31.02,66.52 90 top
R49  270  [0402-RES]  22.77,62.32 0 top
R50  2k7  [0402-RES]  27.5,66.45 270 top
R51  10k  [0402-RES]  24.95,66.45 270 top
R53  4K7  [R0402]  10.38,12.65 0 top
R57  4K7  [R0402]  54.53,12.02 270 top
R58  10k  [R0402]  51.18,14.8 90 top
R59  10k  [R0402]  51.17,12.67 90 top
R61  634K  [R0402]  67.62,20.1 0 top
R62  200K  [R0402]  65.15,19.25 180 top
R63  200k  [R0402]  62.45,19.27 0 top
R64  200k  [R0402]  59.27,20.18 180 top
R65  10  [R0402]  49.85,17.32 90 top
R66  10K  [R0402]  30.07,25.15 270 top
R67  10K  [R0402]  30.07,27.9 90 top
R68  10K  [R0402]  30.05,30.22 270 top
R69  10K  [R0402]  30.3,32.77 270 bottom
SHLD1  BMI-S-202  [BMI-S-202]  51.15,42.95 180 top
SHLD2  BMI-S-208  [BMI-S-208]  12.63,4.1 0 top
SW1  B3U-1000P  [B3U-1000P]  7.62,5.44 0 top
SW2  B3U-1000P  [B3U-1000P]  9.21,17.41 0 top
SW4  B3U-1000P  [B3U-1000P]  9.23,14.68 0 top
U1  6SLX9FTG256  [FT256]  26.8,14.2 0 top
U2  LTC3407A  [MSOP10]  63.8,21.57 90 top
U3  STM32-M-64-LQFP  [LQFP64]  20.52,29.89 0 top
U7  CC1110  [QFN50P595X595X90-37N]  27.57,61.75 0 top
U8  B4050  [B4050]  41.22,39.75 180 top
U9  B4050  [B4050]  46.77,37.31 180 top
U10  MAX2769  [MAX2769]  41.74,33.68 180 top
U11  SN74LVC07A_SOIC  [SN74LVC07A_SOIC]  44.5,18.61 180 top
U12  PT7M8206B33TA5EX  [PT7M8206B33TA5EX]  48.2,28.8 180 top
U13  M25PX80  [M25P]  40.91,9.78 180 top
X2  ASVTX-11  [ASVTX-11]  37.84,29.36 0 top

## Tracks (layer width: path | path; a pad name or v marks a point on that pad's centre or on a via)
5VUSB  (via drill 0.3 pad 0.61)
  Top 0.305: 16.39,30.14 16.54,30.14 v16.77,30.38 | 16.39,30.14 U3.8 | v67.7,10.5 67.7,10.95 | 67.7,10.95 D1.A 67.7,12.05 69.05,13.4 69.05,14.95 Q3.G | 16.39,30.14 16.81,30.23 v16.77,30.38 | 16.39,30.14 16.66,30.47 v16.77,30.38 | 67.7,10.95 67.56,10.55 v67.7,10.5 | 67.7,10.95 67.84,10.55 v67.7,10.5
  Top 0.406: J6.PIN_1 5.55,32.92 5.95,33.33 6.05,33.33 | v6.5,33.33 6.05,33.33 | 6.05,33.33 6.48,33.23 v6.5,33.33 | 6.05,33.33 6.48,33.42 v6.5,33.33
  Bottom 0.406: 16.46,30.06 14.78,28.38 14.78,27.65 13.68,26.55 11.05,26.55 10.4,27.2 10.4,29.42 6.82,33.01 | 16.46,30.06 v16.77,30.38 | 67.25,10.5 56.95,10.5 56.25,9.8 54.6,9.8 53.98,9.2 54,6 53.67,5.67 43.3,5.67 42.92,5.3 38.35,5.3 37.55,4.5 22.32,4.5 19.68,7.15 19.68,8 17.8,9.85 15.03,9.85 14.2,9.02 10.7,9.02 10.2,9.52 10.2,15.1 4.35,20.95 4.35,31.18 6.18,33.01 | 67.25,10.5 v67.7,10.5 | v6.5,33.33 6.82,33.01 | v6.5,33.33 6.18,33.01 | 16.46,30.06 16.83,30.29 v16.77,30.38 | 16.46,30.06 16.69,30.43 v16.77,30.38 | 6.82,33.01 6.59,33.38 v6.5,33.33 | 6.82,33.01 6.45,33.24 v6.5,33.33 | 6.18,33.01 6.55,33.24 v6.5,33.33 | 6.18,33.01 6.41,33.38 v6.5,33.33 | 67.25,10.5 67.68,10.4 v67.7,10.5 | 67.25,10.5 67.68,10.6 v67.7,10.5
16MHZ_FPGA_OUT  (via drill 0.3 pad 0.61)
  Top 0.203: U1.B1 16.25,20.7 15.75,21.2 15.75,24.42 17.23,25.9 17.23,27.23 | 17.23,27.23 v17.23,27.67 | U3.5 16.51,31.64 17.38,30.77 | v17.7,30.45 17.38,30.77 | 17.23,27.23 17.41,27.58 v17.23,27.67 | 17.23,27.23 17.04,27.58 v17.23,27.67 | 17.38,30.77 17.51,30.39 v17.7,30.45 | 17.38,30.77 17.76,30.64 v17.7,30.45
  Bottom 0.203: v17.23,27.67 17.23,28.12 | 17.23,28.12 17.23,29 17.7,29.48 17.7,30 | 17.7,30 v17.7,30.45 | 17.23,28.12 17.04,27.77 v17.23,27.67 | 17.23,28.12 17.41,27.77 v17.23,27.67 | 17.7,30 17.88,30.36 v17.7,30.45 | 17.7,30 17.52,30.36 v17.7,30.45
+5V  (via drill 0.3 pad 0.61)
  Top 0.406: v7.05,11.62 | R29.P$1 5.3,15.27 | 5.3,15.27 v5.3,14.83 v5.3,14.82 | 5.3,15.27 5.2,14.85 v5.3,14.82 | 5.3,15.27 5.4,14.85 v5.3,14.82
  Top 0.61: R33.P$1 v7.05,11.62 | Q5.3 v60.45,5.6 | D1.C v65.2,11.95
  pour Route15 (isolate 0.254, rank 2): 65.6,5.25 65.7,10.5 63.3,10.5 63.3,14.6 70.4,14.6 70.4,3.35 68.7,1.65 55.55,1.65 53.7,3.5 0.8,3.5 0.8,23.1 5.8,23.1 5.8,14.2 7.8,12.2 7.8,9.2 6.3,9.2 6.3,6.2 7.2,5.3 12.6,5.3 13.1,5.8 21.8,5.8 22.3,5.2 35.8,5.2 36.7,6.1 57.7,6.1 59.1,7.5 60.75,7.5 62.6,5.25
BATT_CHARGE_GATE  (via drill 0.3 pad 0.61)
  Top 0.203: U3.10 16.84,29.14 17.65,28.32 20.93,28.32 21.2,28.6 23.82,28.6 | 23.82,28.6 v24.28,28.6 | v53.9,12.57 54.35,12.57 | 54.35,12.57 R57.1 | Q5.1 55,6.05 53.73,7.32 53.73,12.16 | 53.73,12.16 53.73,12.32 v53.9,12.57 | 54.35,12.57 53.99,12.76 v53.9,12.57 | 54.35,12.57 53.99,12.39 v53.9,12.57 | 53.73,12.16 54.03,12.42 v53.9,12.57 | 53.73,12.16 53.7,12.56 v53.9,12.57 | 23.82,28.6 24.18,28.42 v24.28,28.6 | 23.82,28.6 24.18,28.78 v24.28,28.6
  Bottom 0.203: v24.28,28.6 24.73,28.6 | 24.73,28.6 27.62,28.6 28.62,27.6 28.62,26.95 29.82,25.75 34.4,25.75 39.85,20.3 39.85,17.6 42.55,14.9 51.53,14.92 53.58,12.89 | 53.58,12.89 v53.9,12.57 | 53.58,12.89 53.71,12.51 v53.9,12.57 | 53.58,12.89 53.96,12.77 v53.9,12.57 | 24.73,28.6 24.37,28.78 v24.28,28.6 | 24.73,28.6 24.37,28.42 v24.28,28.6
BOOT0
  Top 0.203: U3.60 18.77,36.42 18.98,36.62 R43.P$2 | R43.P$2
CS  (via drill 0.3 pad 0.61)
  Top 0.203: U10.10 38.7,34.18 38.4,34.48 37.94,34.48 | v37.49,34.48 37.94,34.48 | R7.2 37.03,34.48 v37.49,34.48 | L11.P$1 32.61,38.34 33.85,37.1 34.48,37.1 | 34.48,37.1 v34.92,37.1 | 37.94,34.48 37.58,34.66 v37.49,34.48 | 37.94,34.48 37.58,34.3 v37.49,34.48 | v37.49,34.48 37.39,34.3 37.04,34.48 37.4,34.66 v37.49,34.48 | 34.48,37.1 34.83,36.92 v34.92,37.1 | 34.48,37.1 34.83,37.28 v34.92,37.1
  Bottom 0.203: v34.92,37.1 35.38,37.1 | 35.38,37.1 36.08,37.1 37.48,35.7 37.48,34.93 | 37.48,34.93 37.48,34.49 v37.49,34.48 | 37.48,34.93 37.3,34.57 v37.49,34.48 | 37.48,34.93 37.66,34.58 v37.49,34.48 | 35.38,37.1 35.02,37.28 v34.92,37.1 | 35.38,37.1 35.02,36.92 v34.92,37.1
FE_CLK
  Top 0.203: C20.2 40.15,28.92 39.61,29.46 39.44,29.46 X2.4
FPGA_BUTT0
  Top 0.203: R53.2 SW4.P$2 11.1,14.67 13.25,14.67 14.1,15.52 17.48,15.52 U1.J1
FPGA_BUTT1
  Top 0.203: SW2.P$2 10.91,16.94 12.08,15.8 13.6,15.8 14.15,16.35 R40.2 17.65,16.35 U1.H1
FPGA_CONF  (via drill 0.3 pad 0.61)
  Top 0.203: U1.T2 19.8,7.2 19,7.2 18.42,7.78 | v18.1,8.1 18.42,7.78 | R15.2 10.3,6.95 v9.14,6.95 v9.15,6.95 | U3.53 22.27,36.45 22,36.72 22,37.1 21.58,37.52 21.08,37.52 19.58,39.02 15.95,39.02 15.89,38.97 | v15.58,38.65 15.89,38.97 | v9.15,6.95 9.24,7.13 9.6,6.95 9.24,6.77 v9.15,6.95 | 18.42,7.78 18.29,8.16 v18.1,8.1 | 18.42,7.78 18.04,7.91 v18.1,8.1 | 15.89,38.97 15.51,38.84 v15.58,38.65 | 15.89,38.97 15.77,38.59 v15.58,38.65
  Top 0.305: SW1.P$2 9.32,5.97 9.15,6.15 9.15,6.5 | v9.15,6.95 9.15,6.5 | 9.15,6.5 9.29,6.9 v9.15,6.95 | 9.15,6.5 9.01,6.9 v9.15,6.95
  Bottom 0.203: v9.15,6.95 9.6,6.95 | 9.6,6.95 10.4,6.95 11.55,8.1 17.65,8.1 | 17.65,8.1 v18.1,8.1 | 8.83,7.27 8.3,7.8 8.3,13.2 4.48,17.05 3.53,18 3.53,31.45 4.48,32.4 10.75,38.65 15.12,38.65 | 8.83,7.27 v9.15,6.95 | 15.12,38.65 v15.58,38.65 | 9.6,6.95 9.24,7.13 v9.15,6.95 | 9.6,6.95 9.24,6.77 v9.15,6.95 | 8.83,7.27 8.96,6.89 v9.15,6.95 | 8.83,7.27 9.21,7.14 v9.15,6.95 | 17.65,8.1 18.01,7.92 v18.1,8.1 | 17.65,8.1 18.01,8.28 v18.1,8.1 | 15.12,38.65 15.48,38.47 v15.58,38.65 | 15.12,38.65 15.48,38.83 v15.58,38.65
FPGA_D1_MISO2  (via drill 0.3 pad 0.61)
  Top 0.203: U1.N12 30.8,10.2 32.6,10.2 32.8,10 32.8,9.4 33,9.2 34.65,9.2 34.98,9.52 34.98,9.9 36.75,11.67 39.7,11.67 39.93,11.91 | 40.27,12.67 40.27,12.37 v40.25,12.22 | 40.27,12.67 U13.P$3 | 39.93,11.91 v40.25,12.22 | 40.27,12.67 40.07,12.32 v40.25,12.22 | 40.27,12.67 40.44,12.31 v40.25,12.22 | 39.93,11.91 40.31,12.03 v40.25,12.22 | 39.93,11.91 40.06,12.29 v40.25,12.22
  Bottom 0.203: v40.25,12.22 40.25,11.77 | 40.25,11.77 R12.1 | 40.25,11.77 40.43,12.13 v40.25,12.22 | 40.25,11.77 40.07,12.13 v40.25,12.22
FPGA_D2_MISO3  (via drill 0.3 pad 0.61)
  Top 0.203: U1.P12 30.8,8.2 31.65,8.2 31.8,8.05 31.8,7.4 32,7.2 33.62,7.2 33.8,7.37 33.8,7.97 34,8.17 34.83,8.17 35.2,7.8 37.38,7.8 37.83,8.25 40.75,8.25 41.23,7.77 | 41.23,7.77 v41.55,7.45 | 41.54,7 v41.54,7.44 v41.55,7.45 | 41.54,7 U13.P$7 | 41.23,7.77 41.36,7.39 v41.55,7.45 | 41.23,7.77 41.61,7.64 v41.55,7.45 | 41.54,7 41.73,7.35 v41.55,7.45 | 41.54,7 41.37,7.36 v41.55,7.45
  Bottom 0.203: 42,7.46 41.56,7.46 v41.55,7.45 | 42,7.46 R11.1 | 42,7.46 41.64,7.63 v41.55,7.45 | 42,7.46 41.65,7.27 v41.55,7.45
FPGA_LED0
  Top 0.203: U1.E1 17.6,17.7 14.15,21.15 12.23,21.15 12.02,20.94 R46.P$2
FPGA_LED1
  Top 0.203: U1.G1 18.1,16.9 17.58,16.9 13.88,20.6 12.4,20.6 11.55,19.75 R44.P$2
FPGA_M0  (via drill 0.3 pad 0.61)
  Top 0.203: v28.8,7.2 29.12,6.88 | 29.12,6.88 U1.T11 | 29.12,6.88 28.99,7.26 v28.8,7.2 | 29.12,6.88 28.74,7.01 v28.8,7.2
  Bottom 0.203: v28.8,7.2 28.8,7.05 29.03,6.82 | R19.1 29.03,6.82 | 29.03,6.82 29,7.22 v28.8,7.2 | 29.03,6.82 28.69,7.03 v28.8,7.2
FPGA_M1  (via drill 0.3 pad 0.61)
  Top 0.203: U1.N11 29.8,9.2 29.8,8.65 | 29.8,8.65 v29.8,8.2 | 29.8,8.65 29.62,8.29 v29.8,8.2 | 29.8,8.65 29.98,8.29 v29.8,8.2
  Bottom 0.203: 30.24,8.28 29.88,8.28 v29.8,8.2 | 30.24,8.28 R20.2 | 30.24,8.28 29.86,8.39 v29.8,8.2 | 30.24,8.28 29.92,8.04 v29.8,8.2
FPGA_TCK
  Top 0.203: U1.C14 32.8,20.2 33.6,20.2 33.8,20.4 33.8,22.2 32.83,23.17 32.83,23.73 33.4,24.3 33.4,30.77 J2.4
  Bottom 0.203: R69.2 J2.4
FPGA_TDI
  Top 0.203: U1.C12 30.8,20.2 30.8,22.35 29.25,23.9 29.25,28.1 29.6,28.45 R67.2 30.64,28.45 J2.2
FPGA_TDO
  Top 0.203: U1.E14 31.8,18.2 31.8,19 31.6,19.2 30,19.2 29.8,19.4 29.8,22.62 28.75,23.67 28.75,28.92 29.5,29.67 R68.2 J2.3
FPGA_TMS
  Top 0.203: U1.A15 31.95,23.05 J2.1 R66.2
FT_USB_DM
  Top 0.203: J6.PIN_2 R21.P$1
FT_USB_DP
  Top 0.203: J6.PIN_3 5.91,31.62 R22.P$1
GND  (via drill 0.3 pad 0.61)  (1 unrouted)
  Top 0.203: U1.L2 20.48,11.52 | 20.48,11.52 v20.8,11.2 | v21.8,9.2 21.48,8.88 | 21.48,8.88 U1.P3 | v41.75,34.62 41.74,34.36 41.74,34.17 | v42.59,33.69 42.43,33.68 42.14,33.68 | v40.94,33.69 41.05,33.68 41.39,33.68 | U10.29 41.39,33.68 | U10.29 42.14,33.68 | U10.29 41.74,34.17 | 41.74,33.15 41.74,33.02 v41.73,32.7 | 41.74,33.15 U10.29 | SHLD1.5 34.35,33.85 | 34.35,33.85 v34.35,33.4 | SHLD2.21 52.53,30.1 | 52.53,30.1 v52.53,29.65 | v52.53,29.65 | 20.48,11.52 20.61,11.14 v20.8,11.2 | 20.48,11.52 20.86,11.39 v20.8,11.2 | 21.48,8.88 21.86,9.01 v21.8,9.2 | 21.48,8.88 21.61,9.26 v21.8,9.2 | 41.39,33.68 41.03,33.87 v40.94,33.69 | 41.39,33.68 41.03,33.5 v40.94,33.69 | 42.14,33.68 42.5,33.5 v42.59,33.69 | 42.14,33.68 42.49,33.87 v42.59,33.69 | 41.74,34.17 41.93,34.53 v41.75,34.62 | 41.74,34.17 41.57,34.53 v41.75,34.62 | 41.74,33.15 41.55,32.8 v41.73,32.7 | 41.74,33.15 41.91,32.79 v41.73,32.7 | 34.35,33.85 34.17,33.49 v34.35,33.4 | 34.35,33.85 34.53,33.49 v34.35,33.4 | 52.53,30.1 52.34,29.74 v52.53,29.65 | 52.53,30.1 52.71,29.74 v52.53,29.65
  Top 0.254: 26.82,4.45 v26.82,3.4 | 32.83,4.42 v32.83,3.4
  Top 0.305: v19.8,15.2 20.12,15.52 | 20.12,15.52 U1.G2 | U1.N13 31.48,9.52 | 31.48,9.52 v31.8,9.2 | U1.K9 27.48,12.52 | 27.48,12.52 v27.8,12.2 | v25.8,13.2 26.12,13.52 | 26.12,13.52 U1.J8 | U1.K7 25.48,12.88 | 25.48,12.88 v25.8,13.2 | U1.H9 27.12,14.88 | 27.12,14.88 v26.8,15.2 | v25.8,15.2 26.12,15.52 | 26.12,15.52 U1.G8 | U1.H7 25.48,14.88 | 25.48,14.88 v25.8,15.2 | U1.D4 22.12,18.88 | 22.12,18.88 v21.8,19.2 | v25.8,11.2 26.12,10.88 | 26.12,10.88 U1.M8 | v33.8,11.2 33.48,11.52 | 33.48,11.52 U1.L15 | U1.J5 23.12,13.52 | 23.12,13.52 v22.8,13.2 | v30.8,15.2 30.48,14.88 | 30.48,14.88 U1.H12 | U1.E9 27.12,17.88 | 27.12,17.88 v26.8,18.2 | U1.D13 31.12,18.52 | 31.12,18.52 v30.8,18.2 | U1.B7 25.48,20.88 | 25.48,20.88 v25.8,21.2 | v27.8,8.2 28.12,7.88 | 28.12,7.88 U1.R10 | U1.G15 33.48,15.88 | 33.48,15.88 v33.8,16.2 | v28.8,21.2 29.12,20.88 | 29.12,20.88 U1.B11 | U1.R6 24.17,7.57 | 24.17,7.57 v23.85,7.25 | 35.7,27.27 v36.15,27.27 v36.16,27.27 | 35.7,27.27 C45.2 | v38.41,26.69 38.41,26.7 38.41,27.14 | 38.41,27.14 R10.1 38.69,27.59 X2.3 | 36.13,35.03 35.99,34.89 v35.7,34.89 | 36.13,35.03 R8.1 | v35.7,34.89 35.7,34.44 | 35.7,34.44 R7.1 35.7,34.05 | 35.7,34.05 v35.7,33.6 | v35.7,33.6 35.7,33.57 35.7,33.15 | C19.2 C18.2 35.7,33.15 | U1.T16 34.46,6.86 | 34.46,6.86 v34.77,7.17 | U1.A16 34.48,21.88 | 34.48,21.88 v34.8,22.2 | v48.2,26.88 48.2,27.32 | 48.2,27.32 U12.2 | C11.1 49.55,30.95 v49.92,30.95 | U11.7 40.69,22.57 | 40.69,22.57 40.69,22.99 v40.7,23.02 | 38.8,13.43 v38.36,13.43 v38.35,13.42 | 38.8,13.43 U13.P$4 | C48.2 44.48,8.17 | 44.48,8.17 v44.92,8.17 | 45.38,8.16 44.94,8.16 v44.92,8.17 | 45.38,8.16 C47.2 | U1.T1 19.1,6.7 | 19.1,6.7 v18.65,6.7 | U1.A1 19.22,21.78 | 19.22,21.78 v18.9,22.1 | J6.GND_UP_LEFT 5.35,34.72
  Top 0.305: 5.35,34.72 5.57,34.72 v5.8,34.72 | R40.1 14.43,17.45 | 14.43,17.45 v13.98,17.45 | SHLD2.20 13.12,17.65 13.33,17.45 13.53,17.45 | v13.98,17.45 13.53,17.45 | 27.78,32.05 v28.22,32.05 v28.23,32.05 | 27.78,32.05 C82.1 | 28.68,32.05 R24.1 | 28.68,32.05 v28.23,32.05 | v29,43.22 | U3.18 17.27,23.36 | 17.27,23.36 17.27,23.13 v17.45,22.95 | U3.12 15.45,28.14 | 15.45,28.14 15.87,28.14 v15.9,28.1 | v63.03,20.57 63.34,20.89 | 63.34,20.89 63.8,21.35 U2.GP 63.8,21.8 64.26,22.26 | 64.26,22.26 v64.58,22.57 | U2.5 65.9,22.6 | 65.9,22.6 v65.9,23.05 | C46.2 48.15,12.8 | 48.15,12.8 v47.7,12.8 | C51.1 27.35,36.02 | 27.35,36.02 26.94,36.02 v26.9,36 | 26.45,36.02 26.88,36.02 v26.9,36 | 26.45,36.02 C52.2 | v17.27,34.5 17.27,34.95 | 17.27,34.95 U3.63 | D6.RC D6.GC 7.57,19.52 | 7.57,19.52 v7.57,19.08 v7.57,19.07 | J8.1 5.33,22.95 | 5.33,22.95 v5.33,23.4 v5.32,23.4 | R43.P$1 19.15,38.05 | 19.15,38.05 v19.6,38.05 | C42.2 42.55,28.42 | 42.55,28.42 v43,28.42 | v43,28.42 | 44.63,29.83 C43.2 45.05,29.83 | 44.63,29.83 44.2,29.83 v44.18,29.81 | C9.2 45.92,29.59 | 45.92,29.59 45.82,29.7 v45.48,29.69 | 45.05,29.83 45.32,29.83 45.48,29.67 | C70.2 33.02,58.22 | 33.02,58.22 v33.02,57.78 | v33.02,57.78 | v29.38,56.85 29.38,57.3 | 29.38,57.3 C34.2 | C35.2 33.67,60.38 | 33.67,60.38 v34.12,60.38 | C69.2 35.55,58.72 | 35.55,58.72 35.55,59.08 v35.55,59.17 | v37.33,59.75 37.33,60.2 | 37.33,60.2 C68.2 | C27.2 33.42,63.72 | 33.42,63.72 v33.88,63.72 | v33.88,63.72 | C32.2 33.42,64.95 | 33.42,64.95 v33.88,64.95 | C65.2 35.12,64.95 | 35.12,64.95 v35.12,65.4 | v35.12,65.4 | C64.2 39.33,61.72 | 39.33,61.72 39.33,61.88 v39.33,62.17 | C2.2 39.52,59.47 | 39.52,59.47 39.77,59.47 v39.98,59.47 | C26.2 29.82,67.03 | 29.82,67.03 30.25,67.03
  Top 0.305: 30.25,67.03 v30.28,67.03 | 31.25,67.03 R48.P$2 30.73,67.03 | 31.25,67.03 v31.7,67.03 | v31.7,67.03 | 30.25,67.03 30.73,67.03 | 30.25,67.03 | U11.9 41.96,16.5 | 41.96,16.5 41.96,16.79 v41.98,16.95 | C6.1 51.17,18.6 | 51.17,18.6 v51.17,19.05 | v51.17,19.05 | C7.1 50.23,20.94 | 50.23,20.94 50.66,20.94 v50.67,20.92 | v51.17,11.45 51.17,11.9 | 51.17,11.9 R59.1 | C59.1 48.3,34.88 48.09,35.08 | v47.78,35.4 48.09,35.08 | U9.1 47.77,35.85 | 47.77,35.85 v47.77,35.4 v47.78,35.4 | U9.3 48.07,38.75 | 48.07,38.75 v48.07,39.2 v48.08,39.2 | C74.2 26.23,67.03 | 26.23,67.03 25.82,67.03 v25.78,67.03 | C25.2 22.25,63.47 22.09,63.63 | 22.09,63.63 v21.77,63.95 | 20.12,15.52 19.73,15.34 v19.8,15.2 | 20.12,15.52 19.94,15.13 v19.8,15.2 | 31.48,9.52 31.66,9.13 v31.8,9.2 | 31.48,9.52 31.87,9.34 v31.8,9.2 | 27.48,12.52 27.66,12.13 v27.8,12.2 | 27.48,12.52 27.87,12.34 v27.8,12.2 | 26.12,13.52 25.73,13.34 v25.8,13.2 | 26.12,13.52 25.94,13.13 v25.8,13.2 | 25.48,12.88 25.87,13.06 v25.8,13.2 | 25.48,12.88 25.66,13.26 v25.8,13.2 | 27.12,14.88 26.94,15.26 v26.8,15.2 | 27.12,14.88 26.73,15.06 v26.8,15.2 | 26.12,15.52 25.73,15.34 v25.8,15.2 | 26.12,15.52 25.94,15.13 v25.8,15.2 | 25.48,14.88 25.87,15.06 v25.8,15.2 | 25.48,14.88 25.66,15.26 v25.8,15.2 | 22.12,18.88 21.94,19.27 v21.8,19.2 | 22.12,18.88 21.73,19.06 v21.8,19.2 | 26.12,10.88 25.94,11.26 v25.8,11.2 | 26.12,10.88 25.73,11.06 v25.8,11.2 | 33.48,11.52 33.66,11.13 v33.8,11.2 | 33.48,11.52 33.87,11.34 v33.8,11.2 | 23.12,13.52 22.73,13.34 v22.8,13.2 | 23.12,13.52 22.94,13.13 v22.8,13.2 | 30.48,14.88 30.87,15.06 v30.8,15.2 | 30.48,14.88 30.66,15.26 v30.8,15.2 | 27.12,17.88 26.94,18.27 v26.8,18.2 | 27.12,17.88 26.73,18.06 v26.8,18.2
  Top 0.305: 31.12,18.52 30.73,18.34 v30.8,18.2 | 31.12,18.52 30.94,18.13 v30.8,18.2 | 25.48,20.88 25.87,21.06 v25.8,21.2 | 25.48,20.88 25.66,21.27 v25.8,21.2 | 28.12,7.88 27.94,8.27 v27.8,8.2 | 28.12,7.88 27.73,8.06 v27.8,8.2 | 33.48,15.88 33.87,16.06 v33.8,16.2 | 33.48,15.88 33.66,16.27 v33.8,16.2 | 29.12,20.88 28.94,21.27 v28.8,21.2 | 29.12,20.88 28.73,21.06 v28.8,21.2 | 24.17,7.57 23.79,7.39 v23.85,7.25 | 24.17,7.57 23.99,7.18 v23.85,7.25 | 35.7,27.27 36.1,27.13 v36.16,27.27 | 35.7,27.27 36.1,27.42 v36.16,27.27 | 38.41,27.14 38.27,26.74 v38.41,26.69 | 38.41,27.14 38.56,26.74 v38.41,26.69 | 36.13,35.03 35.71,35.05 v35.7,34.89 | 36.13,35.03 35.8,34.77 v35.7,34.89 | 35.7,34.44 35.85,34.84 v35.7,34.89 | 35.7,34.44 35.56,34.84 v35.7,34.89 | 35.7,34.05 35.56,33.65 v35.7,33.6 | 35.7,34.05 35.85,33.65 v35.7,33.6 | 35.7,33.15 35.85,33.54 v35.7,33.6 | 35.7,33.15 35.56,33.55 v35.7,33.6 | 44.63,29.83 44.22,29.96 v44.18,29.81 | 44.63,29.83 44.23,29.67 v44.18,29.81 | 14.43,17.45 14.03,17.59 v13.98,17.45 | 14.43,17.45 14.03,17.31 v13.98,17.45 | 13.53,17.45 13.92,17.31 v13.98,17.45 | 13.53,17.45 13.92,17.59 v13.98,17.45 | 34.46,6.86 34.84,7.04 v34.77,7.17 | 34.46,6.86 34.64,7.24 v34.77,7.17 | 34.48,21.88 34.87,22.06 v34.8,22.2 | 34.48,21.88 34.66,22.27 v34.8,22.2 | 48.2,27.32 48.06,26.93 v48.2,26.88 | 48.2,27.32 48.34,26.93 v48.2,26.88 | v49.92,30.95 49.85,30.82 49.48,31.02 49.89,31.1 v49.92,30.95 | 40.69,22.57 40.84,22.97 v40.7,23.02 | 40.69,22.57 40.56,22.98 v40.7,23.02 | 38.8,13.43 38.4,13.57 v38.35,13.42 | 38.8,13.43 38.4,13.28 v38.35,13.42 | 44.48,8.17 44.88,8.03 v44.92,8.17 | 44.48,8.17 44.87,8.32 v44.92,8.17 | 45.38,8.16 44.98,8.32 v44.92,8.17
  Top 0.305: 45.38,8.16 44.97,8.03 v44.92,8.17 | 19.1,6.7 18.7,6.84 v18.65,6.7 | 19.1,6.7 18.7,6.56 v18.65,6.7 | 19.22,21.78 19.04,22.16 v18.9,22.1 | 19.22,21.78 18.84,21.96 v18.9,22.1 | 5.35,34.72 5.75,34.58 v5.8,34.72 | 5.35,34.72 5.75,34.87 v5.8,34.72 | 27.78,32.05 28.18,31.91 v28.23,32.05 | 27.78,32.05 28.17,32.19 v28.23,32.05 | 28.68,32.05 28.28,32.19 v28.23,32.05 | 28.68,32.05 28.28,31.91 v28.23,32.05 | 17.27,23.36 17.3,22.94 v17.45,22.95 | 17.27,23.36 17.56,23.05 v17.45,22.95 | 15.45,28.14 15.84,27.96 v15.9,28.1 | 15.45,28.14 15.86,28.25 v15.9,28.1 | 63.34,20.89 62.96,20.71 v63.03,20.57 | 63.34,20.89 63.16,20.51 v63.03,20.57 | 64.26,22.26 64.64,22.44 v64.58,22.57 | 64.26,22.26 64.44,22.64 v64.58,22.57 | 65.9,22.6 66.04,23 v65.9,23.05 | 65.9,22.6 65.76,23 v65.9,23.05 | 48.15,12.8 47.75,12.94 v47.7,12.8 | 48.15,12.8 47.75,12.66 v47.7,12.8 | 27.35,36.02 26.95,36.14 v26.9,36 | 27.35,36.02 26.96,35.86 v26.9,36 | 26.45,36.02 26.84,35.86 v26.9,36 | 26.45,36.02 26.86,36.15 v26.9,36 | 17.27,34.95 17.13,34.55 v17.27,34.5 | 17.27,34.95 17.42,34.55 v17.27,34.5 | 7.57,19.52 7.43,19.13 v7.57,19.07 | 7.57,19.52 7.72,19.13 v7.57,19.07 | 5.33,22.95 5.47,23.35 v5.32,23.4 | 5.33,22.95 5.18,23.35 v5.32,23.4 | 19.15,38.05 19.55,37.91 v19.6,38.05 | 19.15,38.05 19.55,38.19 v19.6,38.05 | 42.55,28.42 42.95,28.28 v43,28.42 | 42.55,28.42 42.95,28.57 v43,28.42 | 45.92,29.59 45.56,29.82 v45.48,29.69 | 45.92,29.59 45.5,29.54 v45.48,29.69 | 45.05,29.83 45.38,29.57 v45.48,29.69 | 45.05,29.83 45.47,29.84 v45.48,29.69 | 33.02,58.22 32.88,57.83 v33.02,57.78 | 33.02,58.22 33.17,57.83 v33.02,57.78 | 29.38,57.3 29.23,56.9 v29.38,56.85 | 29.38,57.3 29.52,56.9 v29.38,56.85
  Top 0.305: 33.67,60.38 34.07,60.23 v34.12,60.38 | 33.67,60.38 34.07,60.52 v34.12,60.38 | 35.55,58.72 35.69,59.12 v35.55,59.17 | 35.55,58.72 35.41,59.12 v35.55,59.17 | 37.33,60.2 37.18,59.8 v37.33,59.75 | 37.33,60.2 37.47,59.8 v37.33,59.75 | 33.42,63.72 33.82,63.58 v33.88,63.72 | 33.42,63.72 33.82,63.87 v33.88,63.72 | 33.42,64.95 33.82,64.81 v33.88,64.95 | 33.42,64.95 33.82,65.09 v33.88,64.95 | 35.12,64.95 35.27,65.35 v35.12,65.4 | 35.12,64.95 34.98,65.35 v35.12,65.4 | 39.33,61.72 39.47,62.12 v39.33,62.17 | 39.33,61.72 39.18,62.12 v39.33,62.17 | 39.52,59.47 39.92,59.33 v39.98,59.47 | 39.52,59.47 39.92,59.62 v39.98,59.47 | 29.82,67.03 30.22,66.88 v30.28,67.03 | 29.82,67.03 30.22,67.17 v30.28,67.03 | 30.73,67.03 30.33,67.17 v30.28,67.03 | 30.73,67.03 30.33,66.88 v30.28,67.03 | 31.25,67.03 31.65,66.88 v31.7,67.03 | 31.25,67.03 31.65,67.17 v31.7,67.03 | 41.96,16.5 42.12,16.89 v41.98,16.95 | 41.96,16.5 41.83,16.9 v41.98,16.95 | 51.17,18.6 51.32,19 v51.17,19.05 | 51.17,18.6 51.03,19 v51.17,19.05 | 50.23,20.94 50.62,20.78 v50.67,20.92 | 50.23,20.94 50.63,21.07 v50.67,20.92 | 51.17,11.9 51.03,11.5 v51.17,11.45 | 51.17,11.9 51.32,11.5 v51.17,11.45 | 48.09,35.08 47.91,35.47 v47.78,35.4 | 48.09,35.08 47.71,35.26 v47.78,35.4 | 47.77,35.85 47.63,35.45 v47.78,35.4 | 47.77,35.85 47.92,35.45 v47.78,35.4 | 48.07,38.75 48.22,39.15 v48.08,39.2 | 48.07,38.75 47.93,39.15 v48.08,39.2 | 26.23,67.03 25.83,67.17 v25.78,67.03 | 26.23,67.03 25.83,66.88 v25.78,67.03 | 22.09,63.63 21.91,64.02 v21.77,63.95 | 22.09,63.63 21.71,63.81 v21.77,63.95
  Top 0.406: J9.1 5.32,11.7 v5.32,12.1 | R53.1 9.6,12.65 | 9.6,12.65 v9.15,12.65 | v9.15,12.65 | J4.9 29,42.77 | 29,42.77 v29,43.22 | C84.- 11.19,24.74 11.46,24.47 | 11.46,24.47 v11.78,24.15 | J6.PIN_5 4.73,28.65 J6.GND_UP_RIGHT | U8.1 41.73,38.55 40.58,39.7 39.94,39.7 U8.5 39.48,39.72 39.19,40.01 | v38.88,40.33 39.19,40.01 | U8.4 39.5,40.95 39.19,40.64 | v38.88,40.33 39.19,40.64 | U8.3 42.59,40.95 42.75,41.1 42.75,41.15 | 42.75,41.15 v42.75,41.6 | SHLD1.2 42.58,42.45 42.73,42.3 42.73,42.05 | 42.73,42.05 42.73,41.62 v42.75,41.6 | C81.1 50.53,33.7 50.58,33.75 | 50.58,33.75 50.67,33.65 50.67,33.6 | 50.67,33.6 v50.67,33.15 | U9.5 U9.4 45.47,38.75 | 45.47,38.75 v45.47,39.2 v45.48,39.2 | 29.98,42.8 29.98,42.72 29.78,42.52 29.03,42.52 J4.9 | 29.98,42.8 v29.98,43.25 | J4.7 | C33.2 C26.2 | C26.2 | J10.4 12.97,53.2 v12.98,52 | 6.07,63.5 J3.1 | 6.07,63.5 v6.07,63.94 v6.07,63.95 | D2.C 18.4,65.6 18.58,65.78 | 18.58,65.78 v18.9,66.1 | v18.9,66.1 19.35,66.1 | 19.35,66.1 19.85,66.1 19.98,65.97 C56.2 | R63.2 63,20.13 | 63,20.13 63,20.55 v63.03,20.57 | R62.2 64.6,20.13 | 64.6,20.13 64.6,20.55 v64.58,20.57 | 50.58,33.75 50.65,33.75 SHLD1.11 | v67.25,14.38 67.7,14.38 | 67.7,14.38 67.72,14.38 Q3.S | 42.75,41.15 42.84,41.58 v42.75,41.6 | 42.75,41.15 42.65,41.58 v42.75,41.6 | 42.73,42.05 42.65,41.62 v42.75,41.6 | 42.73,42.05 42.84,41.63 v42.75,41.6 | 50.67,33.6 50.58,33.17 v50.67,33.15 | 50.67,33.6 50.77,33.17 v50.67,33.15 | v5.32,12.1 5.42,12.08 5.32,11.65 5.23,12.08 v5.32,12.1 | 9.6,12.65 9.17,12.75 v9.15,12.65 | 9.6,12.65 9.17,12.55 v9.15,12.65 | 29.98,42.8 30.07,43.23 v29.98,43.25 | 29.98,42.8 29.88,43.23 v29.98,43.25 | 29,42.77 29.1,43.2 v29,43.22 28.9,43.2 29,42.77
  Top 0.406: 67.7,14.38 67.27,14.47 v67.25,14.38 | 67.7,14.38 67.27,14.28 v67.25,14.38 | 63,20.13 63.12,20.55 v63.03,20.57 | 63,20.13 62.92,20.56 v63.03,20.57 | 64.6,20.13 64.67,20.56 v64.58,20.57 | 64.6,20.13 64.48,20.55 v64.58,20.57 | 11.46,24.47 11.69,24.1 v11.78,24.15 | 11.46,24.47 11.83,24.24 v11.78,24.15 | 39.19,40.01 38.96,40.38 v38.88,40.33 | 39.19,40.01 38.82,40.24 v38.88,40.33 | 39.19,40.64 38.82,40.41 v38.88,40.33 | 39.19,40.64 38.96,40.27 v38.88,40.33 | 45.47,38.75 45.57,39.18 v45.48,39.2 | 45.47,38.75 45.38,39.18 v45.48,39.2 | v12.98,52 12.88,52.02 12.97,52.45 13.07,52.02 v12.98,52 | 6.07,63.5 6.17,63.93 v6.07,63.95 | 6.07,63.5 5.98,63.93 v6.07,63.95 | 18.58,65.78 18.95,66.01 v18.9,66.1 | 18.58,65.78 18.81,66.15 v18.9,66.1 | 19.35,66.1 18.92,66.2 v18.9,66.1 | 19.35,66.1 18.92,66 v18.9,66.1 | SHLD2.15
  Top 0.61: v37.58,14.6 37.59,14.66 C86.- 37.59,17.11 38.58,18.1 v38.58,18.73 | 15.78,13.35 v17.48,13.35 | 15.78,13.35 C87.- | SHLD2.15 SHLD2.14 SHLD2.13 SHLD2.2 | J4.3 J4.5 J4.7 | v64.33,15.88 C10.- | C10.- 65.88,15.75 v67.25,14.38 | J6.GND_RIGHT 3.76,27.62 J6.GND_UP_RIGHT v5.8,28.52 | v5.8,28.52 | J6.GND_UP_LEFT 4.58,34.95 3.68,35.85 v3.4,35.85 J6.GND_LEFT | J4.7 J4.9 | v54.23,14.17 55.17,14.17 C3.- 56.5,13.95 v57.25,13.95 | v55.8,16.35 55.8,14.75 | C10.- 65.97,17.43 v65.95,17.45 | C4.- v63.12,27.12 | v61.53,25.62 C4.- | C4.- 59.92,27.12 59.9,27.15 | 15.78,13.35 15.78,13.2 16.75,12.22 v17.48,12.22
  Bottom 0.203: R14.2
  Bottom 0.305: 19.8,15.65 19.8,15.95 C60.2 | 19.8,15.65 v19.8,15.2 | C29.2 22.8,16.46 22.8,16.75 | v22.8,17.2 22.8,16.75 | 27.48,8.52 27.32,8.68 C77.2 | 27.48,8.52 v27.8,8.2 | C76.2 24.79,6.56 24.27,7.08 | 24.27,7.08 24.1,7.25 v23.85,7.25 | C39.2 35.2,34.89 v35.7,34.89 | C12.2 C13.2 41.77,35.07 | 41.77,35.07 41.77,34.64 v41.75,34.62 | 40.49,33.68 v40.94,33.68 v40.94,33.69 | 40.49,33.68 C40.2 | v41.73,32.7 41.42,32.4 41.39,32.4 | C41.2 41.39,32.4 | 23,13.61 23,13.39 v22.8,13.2 | 23,13.61 C28.2 | 21.21,11.02 20.98,11.02 v20.8,11.2 | 21.21,11.02 C8.2 | C71.2 34.39,15.13 33.84,15.68 33.84,15.75 | 33.84,15.75 33.84,16.16 v33.8,16.2 | C67.2 26.21,20.79 26.12,20.88 | v25.8,21.2 26.12,20.88 | C30.2 27.45,18.09 27.32,18.2 27.25,18.2 | v26.8,18.2 27.25,18.2 | C22.2 25.75,11.65 | 25.75,11.65 25.75,11.25 v25.8,11.2 | C44.2 36.14,27.72 | 36.14,27.72 36.14,27.29 v36.16,27.27 | 17.73,19.17 C62.2 | 17.73,19.17 v17.27,19.17 | v34.77,7.17 34.78,7.62 | 34.78,7.62 R14.2 | v31.8,9.2 31.8,8.75 | 31.8,8.75 R20.1 | v21.8,9.2 21.8,9.64 21.79,9.65 | C63.2 21.79,9.65 | 34.25,11.26 33.87,11.26 v33.8,11.2 | 34.25,11.26 C73.2 | 21.35,19.23 21.77,19.23 v21.8,19.2 | 21.35,19.23 R18.1 | C54.2 24.23,27.05 | 24.23,27.05 24.12,27.05 v23.78,27.05 | C72.2 33.81,18.76 33.81,18.65 | 33.81,18.65 v33.8,18.2 | C61.2 27.22,22.8 | 27.22,22.8 26.82,22.8 v26.78,22.82 | v17.45,22.95 17.52,22.95 17.8,23.23 | 17.8,23.23 C55.2 | C83.P$1 13.47,30.64 13.44,30.62 | v13.12,30.3 13.44,30.62 | C85.P$1 13.12,29.85 | 13.12,29.85 v13.12,30.3 | C53.2 17.03,35.05 17.14,34.93 | 17.14,34.93 17.27,34.8 v17.27,34.5 | 43.04,33.7 42.6,33.7 v42.59,33.69 | 43.04,33.7 R6.1 | C23.2 30.8,15.93 30.8,15.62 v30.8,15.2 | C31.2 29.74,14.75
  Bottom 0.305: 29.74,14.75 29.74,15.14 v29.8,15.2 | 22.45,26.74 22.02,26.74 v22,26.73 | 22.45,26.74 R23.2 | C66.2 21.55,26.74 | 21.55,26.74 21.98,26.74 v22,26.73 | 19.8,15.65 19.66,15.25 v19.8,15.2 | 19.8,15.65 19.94,15.25 v19.8,15.2 | 31.8,8.75 31.94,9.15 v31.8,9.2 | 31.8,8.75 31.66,9.15 v31.8,9.2 | 21.35,19.23 21.74,19.06 v21.8,19.2 | 21.35,19.23 21.76,19.35 v21.8,19.2 | 25.75,11.65 25.65,11.24 v25.8,11.2 | 25.75,11.65 25.94,11.27 v25.8,11.2 | 22.8,16.75 22.94,17.15 v22.8,17.2 | 22.8,16.75 22.66,17.15 v22.8,17.2 | 34.25,11.26 33.83,11.35 v33.8,11.2 | 34.25,11.26 33.87,11.06 v33.8,11.2 | 23,13.61 22.69,13.31 v22.8,13.2 | 23,13.61 22.95,13.18 v22.8,13.2 | v30.8,15.2 30.66,15.25 30.8,15.65 30.94,15.25 v30.8,15.2 | 27.25,18.2 26.85,18.34 v26.8,18.2 | 27.25,18.2 26.85,18.06 v26.8,18.2 | 26.12,20.88 25.94,21.27 v25.8,21.2 | 26.12,20.88 25.73,21.06 v25.8,21.2 | 27.48,8.52 27.66,8.13 v27.8,8.2 | 27.48,8.52 27.87,8.34 v27.8,8.2 | 33.84,15.75 33.95,16.16 v33.8,16.2 | 33.84,15.75 33.66,16.14 v33.8,16.2 | 24.27,7.08 23.95,7.36 v23.85,7.25 | 24.27,7.08 23.84,7.1 v23.85,7.25 | 21.21,11.02 20.91,11.31 v20.8,11.2 | 21.21,11.02 20.79,11.05 v20.8,11.2 | 21.79,9.65 21.66,9.25 v21.8,9.2 | 21.79,9.65 21.94,9.25 v21.8,9.2 | 36.14,27.72 36.01,27.32 v36.16,27.27 | 36.14,27.72 36.3,27.33 v36.16,27.27 | v35.7,34.89 35.65,34.75 35.26,34.89 35.65,35.04 v35.7,34.89 | 40.49,33.68 40.89,33.54 v40.94,33.69 | 40.49,33.68 40.89,33.83 v40.94,33.69 | 43.04,33.7 42.63,33.83 v42.59,33.69 | 43.04,33.7 42.64,33.55 v42.59,33.69 | 41.77,35.07 41.61,34.68 v41.75,34.62 | 41.77,35.07 41.9,34.67 v41.75,34.62 | 41.39,32.4 41.78,32.56 v41.73,32.7 | 41.39,32.4 41.59,32.77 v41.73,32.7
  Bottom 0.305: 13.44,30.62 13.06,30.44 v13.12,30.3 | 13.44,30.62 13.26,30.23 v13.12,30.3 | 13.12,29.85 13.27,30.25 v13.12,30.3 | 13.12,29.85 12.98,30.25 v13.12,30.3 | 34.78,7.62 34.63,7.23 v34.77,7.17 | 34.78,7.62 34.92,7.23 v34.77,7.17 | 33.81,18.65 33.66,18.25 v33.8,18.2 | 33.81,18.65 33.94,18.25 v33.8,18.2 | 17.73,19.17 17.33,19.32 v17.27,19.17 | 17.73,19.17 17.33,19.03 v17.27,19.17 | 24.23,27.05 23.83,27.19 v23.78,27.05 | 24.23,27.05 23.83,26.91 v23.78,27.05 | 27.22,22.8 26.84,22.96 v26.78,22.82 | 27.22,22.8 26.82,22.68 v26.78,22.82 | 17.8,23.23 17.4,23.09 v17.45,22.95 | 17.8,23.23 17.58,22.87 v17.45,22.95 | 17.14,34.93 17.12,34.51 v17.27,34.5 | 17.14,34.93 17.4,34.59 v17.27,34.5 | 29.74,14.75 29.94,15.13 v29.8,15.2 | 29.74,14.75 29.65,15.17 v29.8,15.2 | 22.45,26.74 22.05,26.87 v22,26.73 | 22.45,26.74 22.06,26.58 v22,26.73 | 21.55,26.74 21.94,26.58 v22,26.73 | 21.55,26.74 21.95,26.87 v22,26.73 | 17.9,50.25 19.75,50.25 20.85,50.05 20.85,44.02 SHLD2.8
  Bottom 0.406: C24.2 33.35,11.17 | 33.35,11.17 33.77,11.17 v33.8,11.2 | C21.2 24.75,22.25 25.48,21.52 | v25.8,21.2 25.48,21.52 | C38.2 42.41,40.19 C36.2 42.12,40.55 U8.3 42.72,41.15 | C37.2 42.23,41.65 42.3,41.65 | 42.3,41.65 42.7,41.65 v42.75,41.6 | v42.75,41.6 42.75,41.17 42.72,41.15 | 33.35,11.17 33.78,11.1 v33.8,11.2 | 33.35,11.17 33.77,11.3 v33.8,11.2 | 25.48,21.52 25.71,21.15 v25.8,21.2 | 25.48,21.52 25.85,21.29 v25.8,21.2 | 42.3,41.65 42.71,41.5 v42.75,41.6 | 42.3,41.65 42.73,41.7 v42.75,41.6 | 42.72,41.15 42.84,41.57 v42.75,41.6 | 42.72,41.15 42.65,41.58 v42.75,41.6 | SHLD2.27 39.95,44
  other vias: 26.03,63.3 29.12,60.2 27.57,60.2 26.03,60.2 27.57,61.75 26.03,61.75 29.12,61.75 29.12,63.3 27.57,63.3 34.35,40.17 48.88,42.45 50.65,40.17 36.1,42.45 38.83,44 44.83,44 52.53,41.95 50.98,44 52.53,36.3 34.35,28.42 36.12,26.15 42.5,26.15 50.65,28.42 48.88,26.15 14.68,44 13.12,41.95 13.12,36.3 20.83,44 26.82,44 32.83,44 52.53,24.3 52.53,12.3 52.53,6.65 50.98,4.6 44.83,4.6 38.83,4.6 20.83,4.6 14.68,4.6 13.12,6.65 13.12,12.3 13.12,24.3 6.88,6.67 63.03,22.57 59.88,27.15 6.95,43.95 52.53,18.3 69.33,11.05 57.08,25.55 53.53,26.2 57.08,27 57.08,28.5 56.78,31.45 57.08,29.95 54.92,33.5 55.92,32.5 53.73,34.85 51.48,36.45 50.38,36.45 51.08,30.9 51.58,34.85 52.33,33.9 52.53,31.3 53.78,32.4 54.98,31.45 53.53,30.2 54.08,29 54.08,27.55 51.58,26.15 52.48,27.4 51.62,28.95 53.33,23.5 57.03,24.35 55.88,27.7 55.88,29.25 56.03,30.65 50.67,35.5 4.9,5.45 15.95,17.22 11.88,18.85 1.28,18.38 1.18,6.7 9.1,26.92 1.18,43.95 9.1,38.58 27.15,38.77 48.92,9.12 69.7,4.7 43.98,23.82 37.35,40.95 36.17,38.52 43.95,40.95 49.42,38.55 46.45,41.08 47.95,24.7 52.45,21.57 47.73,19.2 39.75,24.02 60.92,18.5 54.55,35.77 55.48,36.72 56.45,37.65 57.3,38.58 58.17,39.45 59.1,40.38 60.45,41.05 61.2,39.22 60.17,38.55 59.33,37.75 58.47,37 57.73,36.1 56.88,35.25 56,34.38 59.15,43.92 55.35,43.12 53.9,39.25 69.65,34.67 69.6,30.88 65.4,30.88 61.35,30.9 58.38,32.52 19.27,26.67 10.78,33.58 10.2,43.27 46.08,10.85 5.95,17.72 22.35,30.12 18.65,31.18 17.8,40.77 30.03,36.45 39.05,9.72 29.07,30.15 44.4,37.38 54,18.4 1.53,53.65 1.53,56.2 1.53,58.9 1.53,61.4 1.53,64 4.93,50.35 4.12,53.15 7.28,56.7 7.78,53.35 11.98,50.2 11.53,54.85 12.43,56.75 14.93,56.75 17.58,56.75 20.77,56.7 17.88,50.35 24.93,55.1 19.02,53.3 23.38,50.35 28.12,50.35 32.58,50.35 7.62,67.5 4.98,67.45 4.07,64.7 9.03,64.3 9.78,66.85 12.83,66.85 16.27,66.9 13.38,62.65 19.98,62.65 16.58,62.7 32.83,55.05 39.92,50.3 39.92,53.35 39.88,56.3 35.33,57.1 36.83,53.8 39.77,67.55 39.77,64.3 36.08,63.5 34.83,67.8 33.17,66.25
  pour Route2 (isolate 0.203): 0.8,3.5 0.8,44.7 25.2,44.7 26.4,44.7 70.3,44.7 70.3,30.2 58.6,30.3 58.6,25.75 56.15,23.25 52.9,23.2 52.9,17.1 53.65,17.1 53.65,22.5 56.35,22.5 59.35,25.45 59.35,29.7 70.3,29.7 70.42,3.15 70.42,3.02 69,1.6 2.5,1.6
  pour Route15 (isolate 0.254): 53.05,23.2 56.3,23.2 58.6,25.6 58.6,30.3 70.2,30.3 70.2,44.7 33.8,44.7 33.8,43.2 51.9,43.2 51.9,36.7 49.8,36.7 48.8,35.7 48.8,31.7 50.8,29.7 50.8,25.45
  pour Top (isolate 0.305, rank 2): 70.35,29.7 70.35,4.25 53.75,4.25 53.75,19.6 59.4,25.25 59.3,29.7
  pour Top (isolate 0.305, rank 3): 0.8,4.1 52.8,4.3 52.8,23.2 56.3,23.2 58.8,25.7 58.8,30.2 70.3,30.2 70.3,44.4 0.8,44.4
  pour Bottom (isolate 0.305, rank 3): 70.3,29.7 59.3,29.7 59.3,25.2 56.8,22.7 53.8,22.7 53.8,4.3 70.4,4.3
  pour Bottom (isolate 0.305, rank 3): 0.8,4.1 0.8,44.4 70.3,44.4 70.3,30.2 58.8,30.2 58.8,25.7 56.3,23.2 52.8,23.2 52.8,4.3
  pour Top: 0.9,68.1 40.25,68.1 40.3,59.1 39.2,58.9 39.15,57.55 40.3,56.75 40.3,49.8 0.9,49.8
  pour Bottom: 40.3,49.8 40.3,68.1 3.5,68.1 0.9,65.5 0.9,49.8
  pour Route2: 0.9,68.1 40.25,68.1 40.25,49.8 0.9,49.8
JTAG_RST  (via drill 0.3 pad 0.61)
  Top 0.203: U3.7 15.6,30.64 | 15.6,30.64 15.79,30.64 v16,30.85 | v16.3,40.8 16.62,41.12 | 16.62,41.12 18.05,42.55 J4.10 | 15.6,30.64 16,30.65 v16,30.85 | 15.6,30.64 15.83,30.97 v16,30.85 | 16.62,41.12 16.24,40.99 v16.3,40.8 | 16.62,41.12 16.49,40.74 v16.3,40.8
  Bottom 0.203: v16,30.85 15.8,30.65 15.6,30.65 | 15.6,30.65 C83.P$2 | 16,31.3 16,31.13 v16,30.85 | 16,31.3 R34.P$1 16,34.45 15.5,34.95 15.5,37.17 16.3,37.95 16.3,40.35 | 16.3,40.35 v16.3,40.8 | 15.6,30.65 16,30.65 v16,30.85 | 15.6,30.65 15.84,30.97 v16,30.85 | 16,31.3 15.82,30.94 v16,30.85 | 16,31.3 16.18,30.94 v16,30.85 | 16.3,40.35 16.48,40.71 v16.3,40.8 | 16.3,40.35 16.12,40.71 v16.3,40.8
JTAG_TCK  (via drill 0.3 pad 0.61)